# EAGLE board top_level (EAGLE 4.15), part 1 of 2
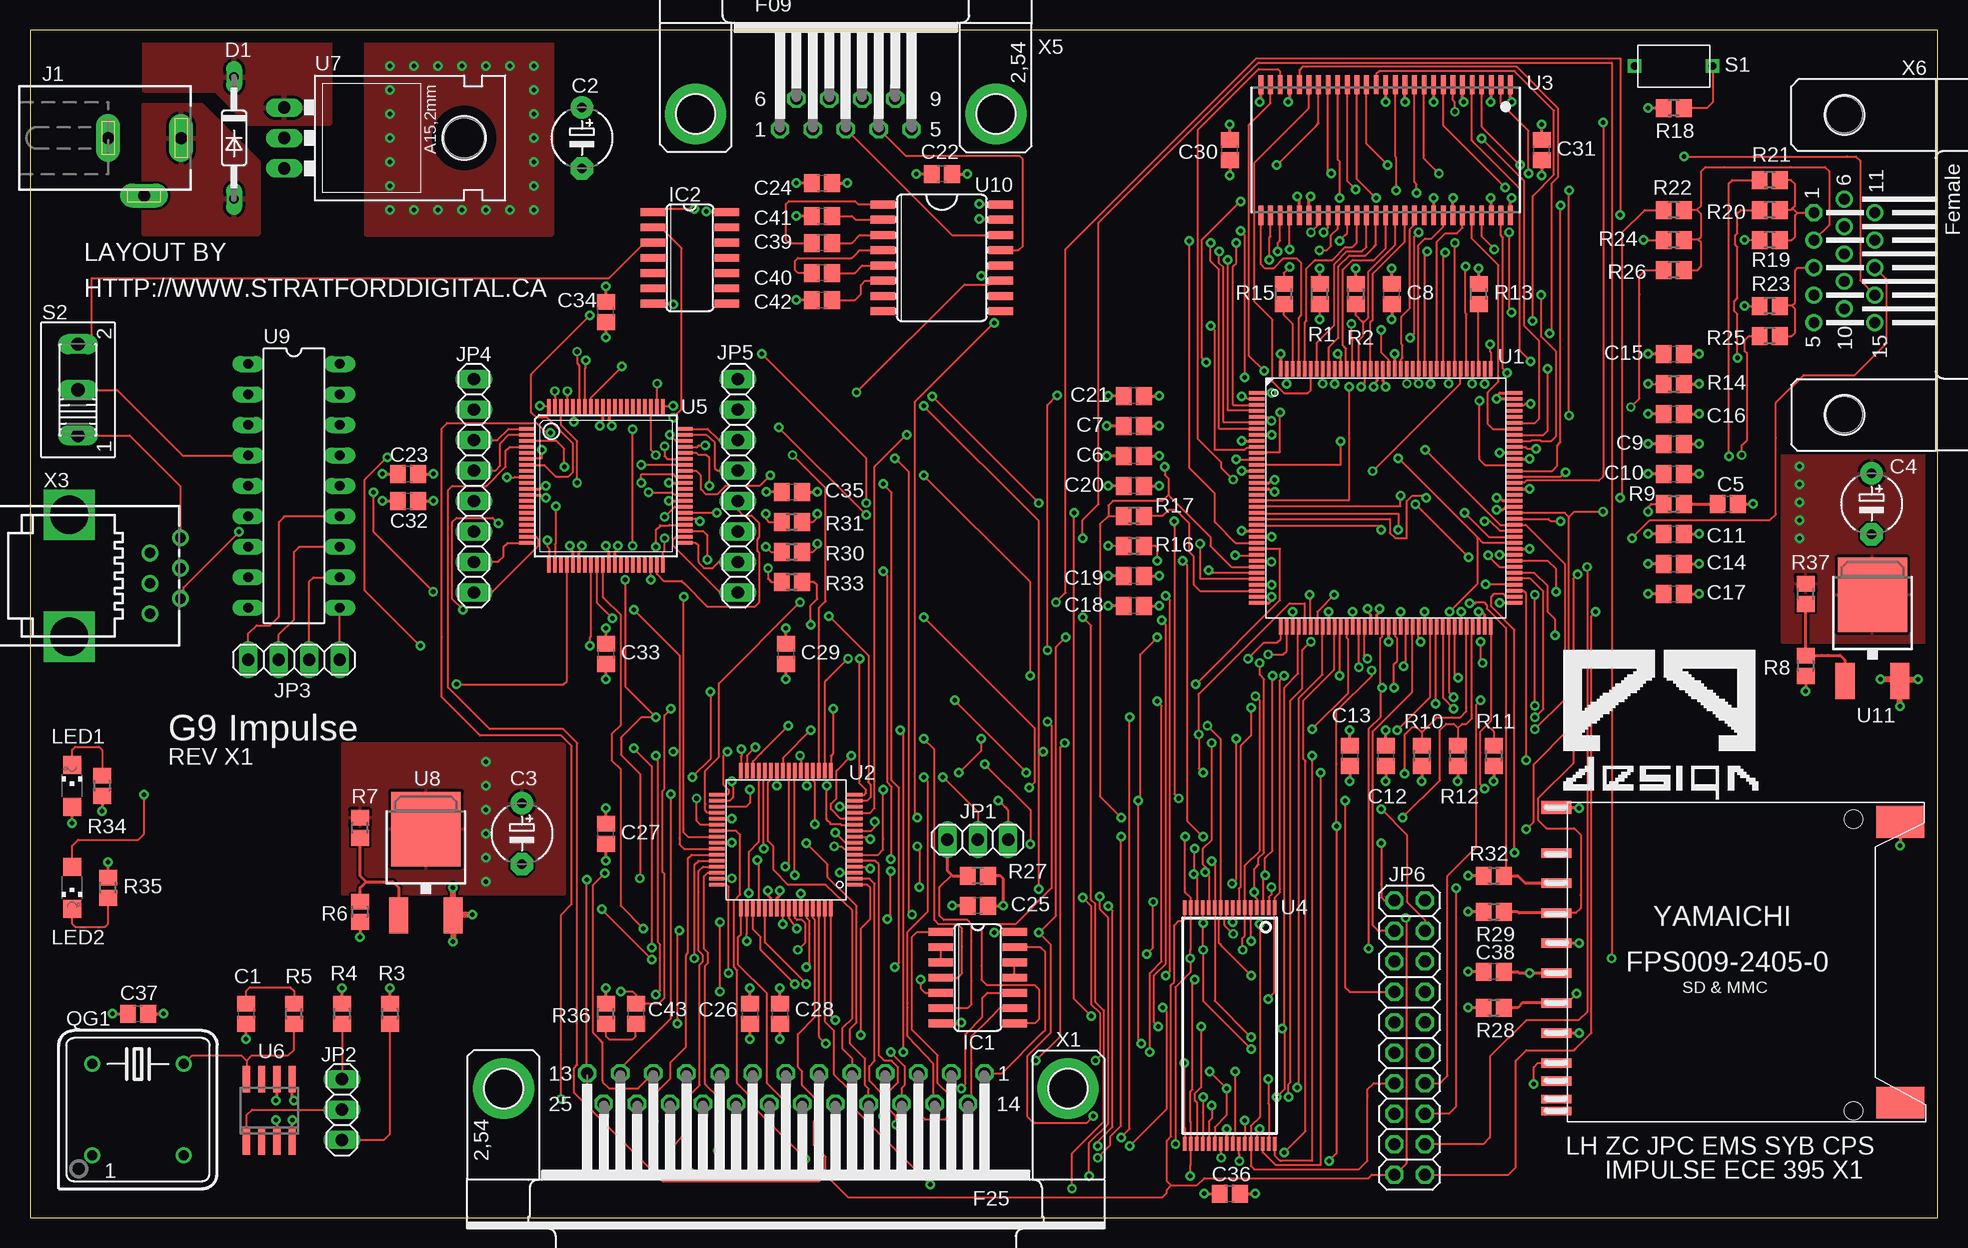
[diagram p1: board, top side]
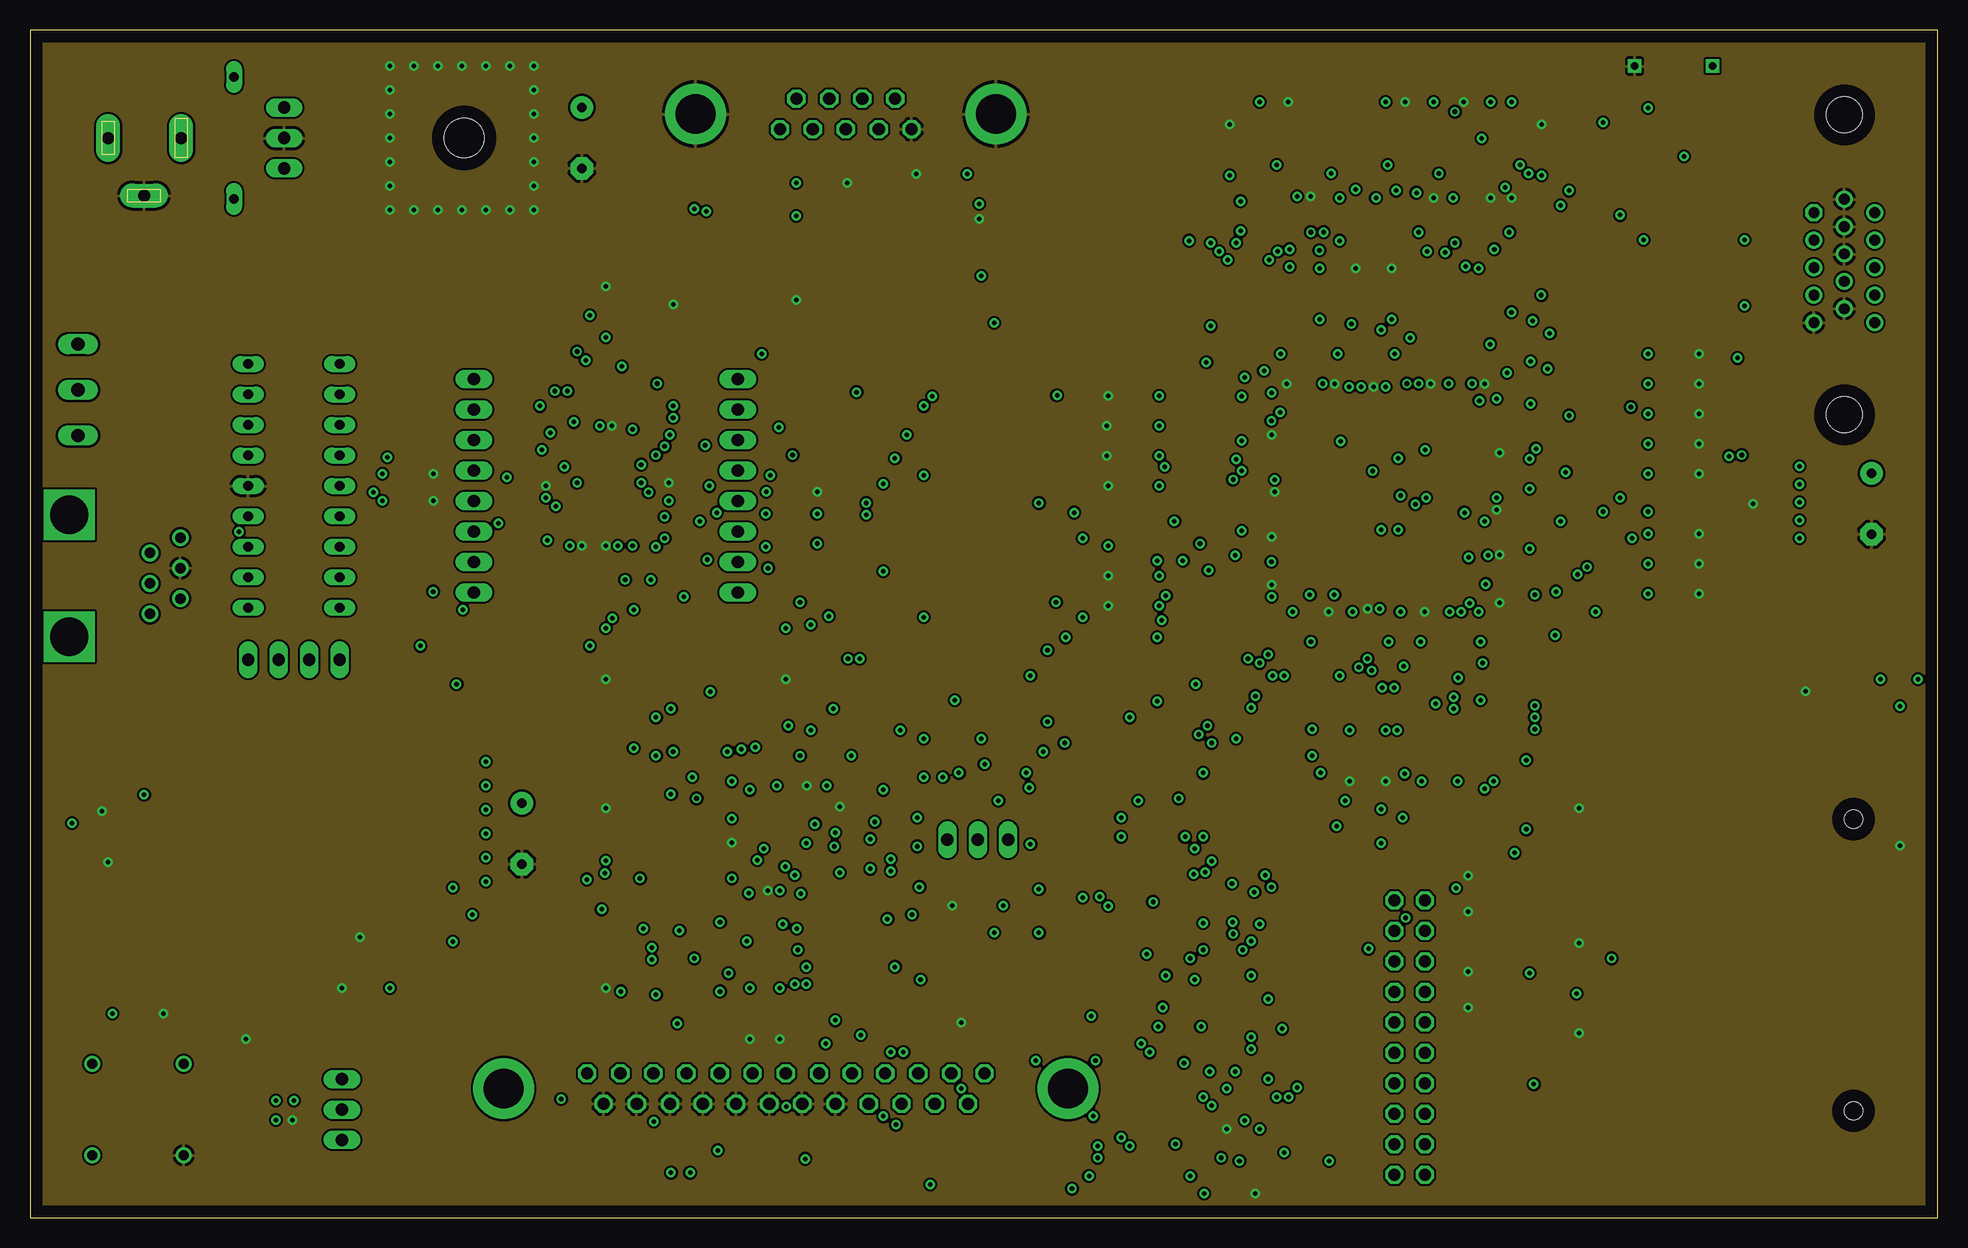
[diagram p2: board, inner layer GND]
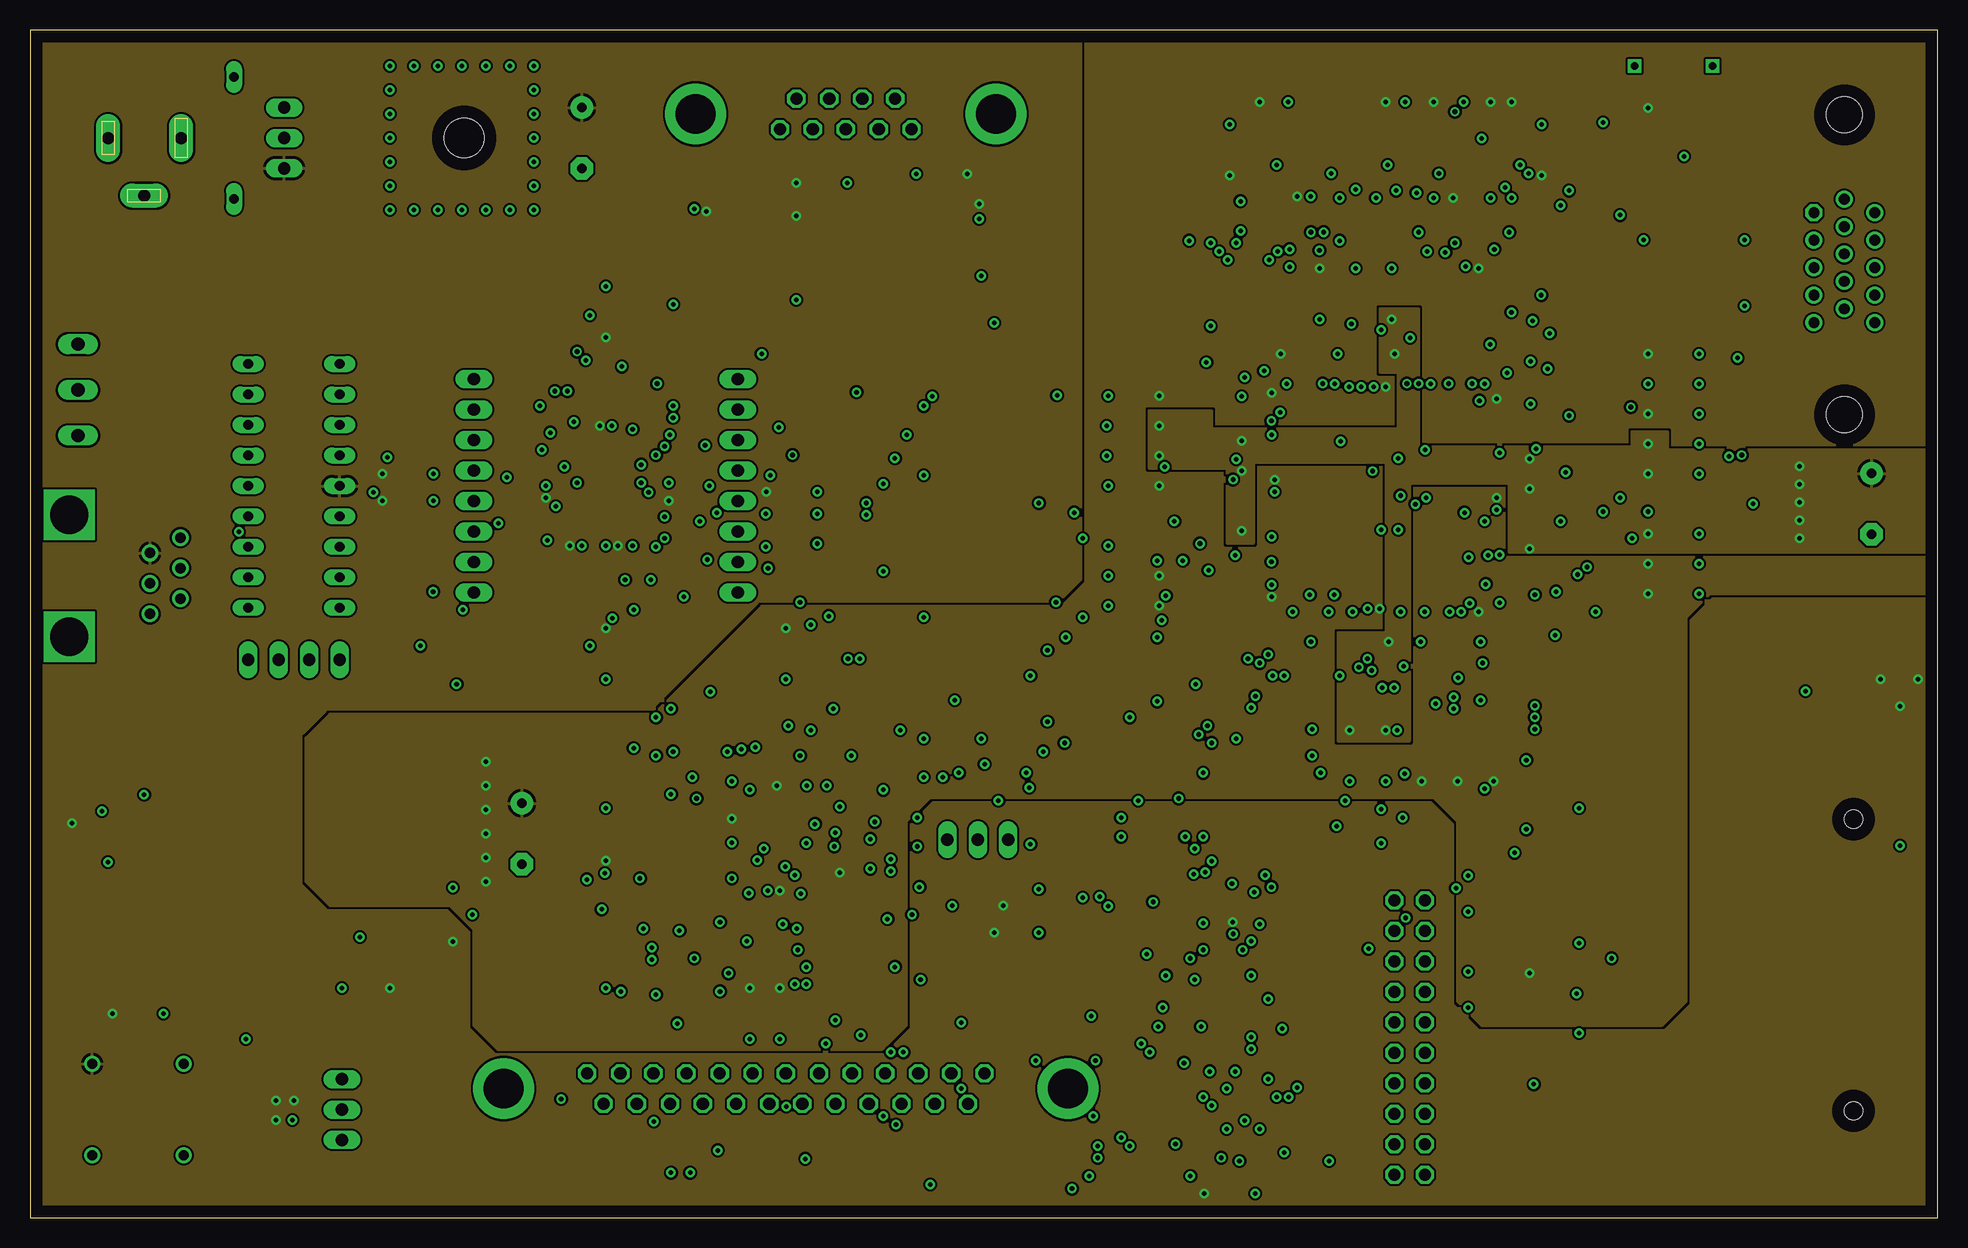
[diagram p3: board, inner layer POWER]
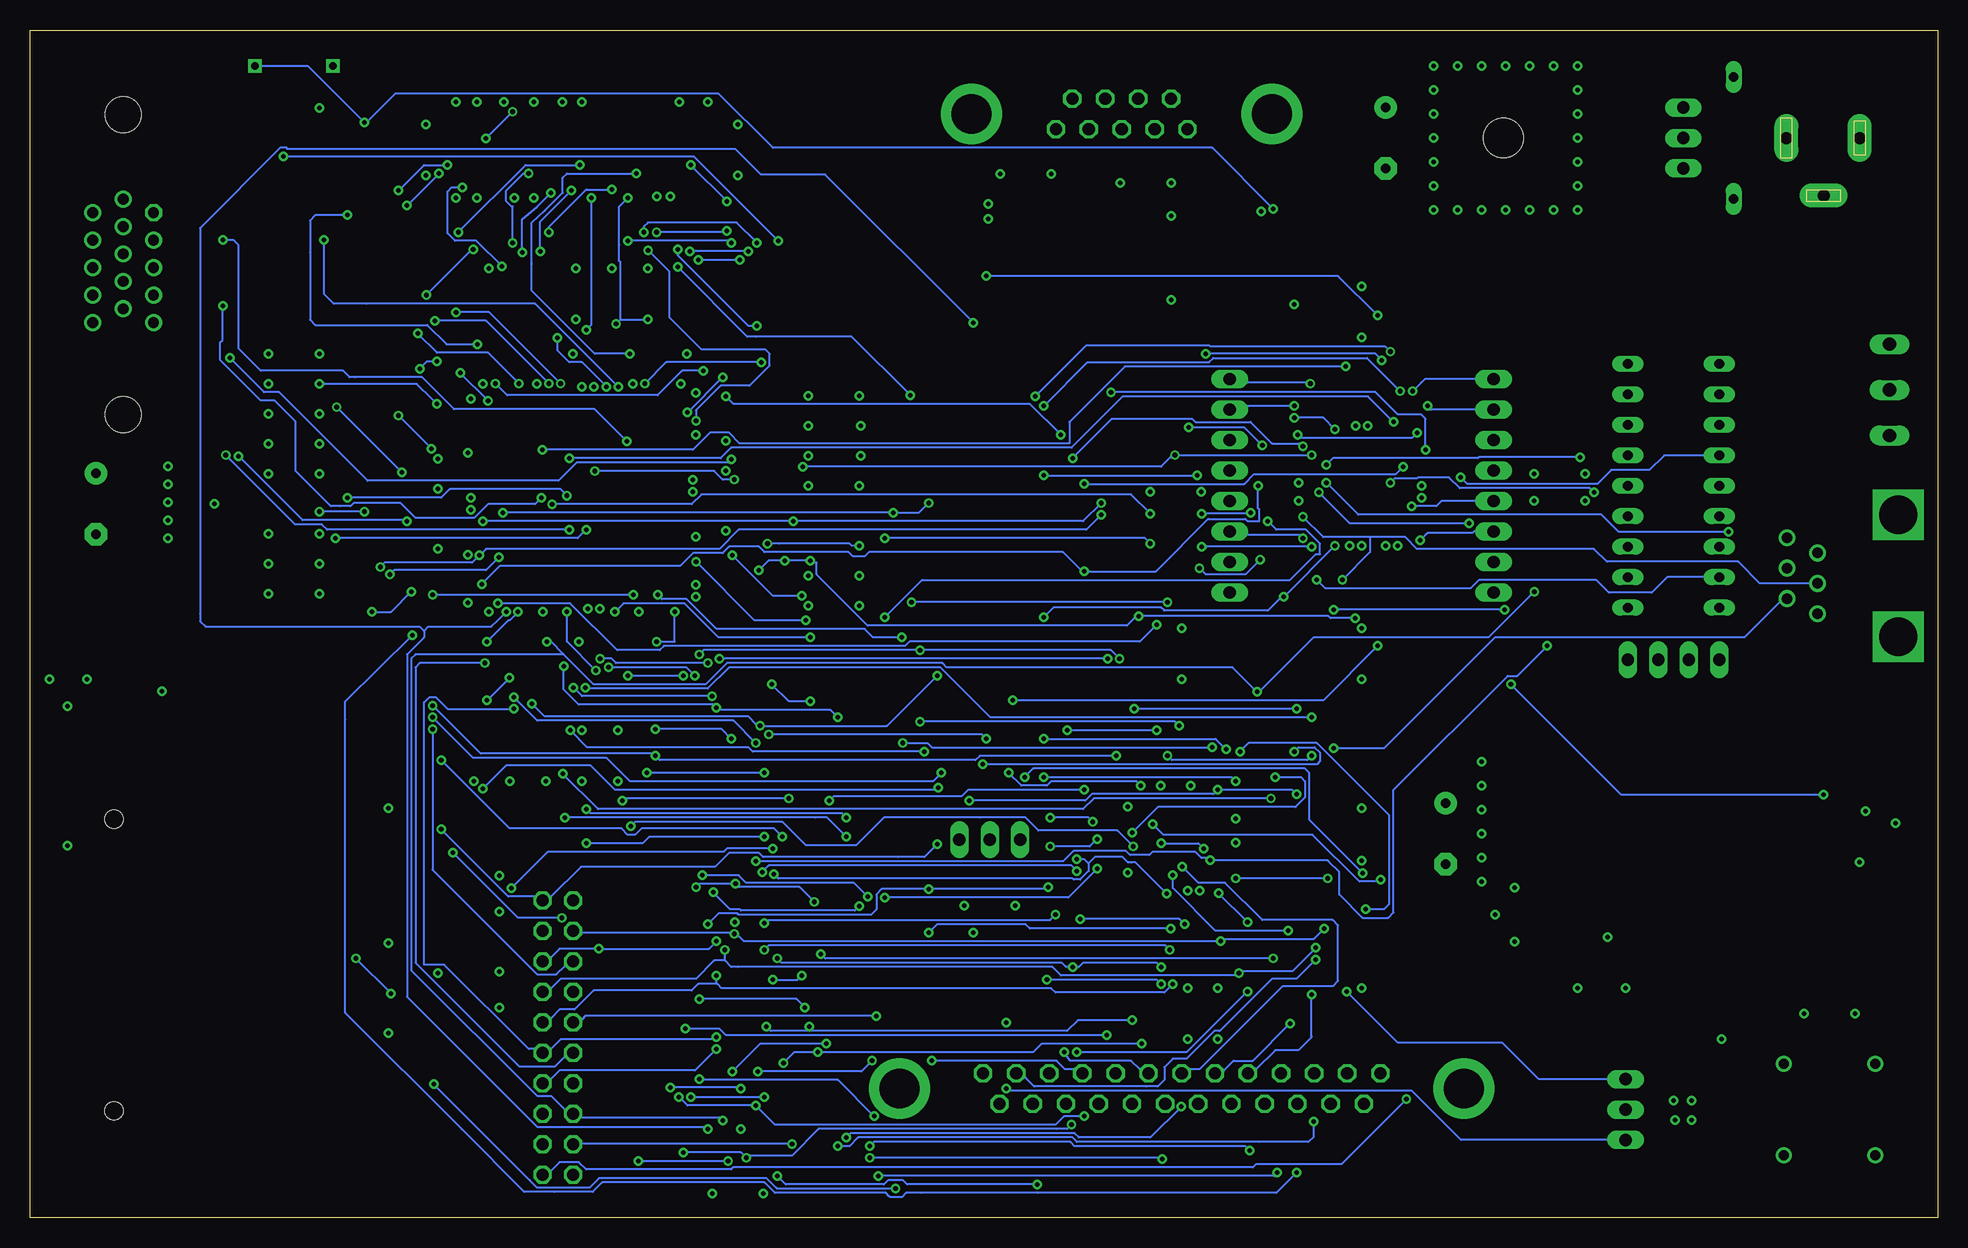
[diagram p4: board, bottom side, seen from below]

Size 159 x 99 mm. Coordinates in mm from the lower left corner, seen from the top.
Outline: 0,0 159,0 159,99 0,99 0,0
Copper layers (1*2+15*16): Top 0.035mm / dielectric 0.2mm / GND 0.035mm / dielectric 0.15mm / POWER 0.035mm / dielectric 0.2mm / Bottom 0.035mm
Design rules "default": minimum track width 7mil, minimum drill 15mil, track to track 7mil, track to pad 7mil, pad to pad 7mil, via to via 7mil, smd to smd 7mil, copper to edge 40mil, drill to drill 8mil, minimum pad ring 10mil, minimum via ring 8mil, stop-mask expansion 4mil, vias tented up to drill 0mil, thermal gap 10mil

## Footprints (pad centres in the part's own frame; a part is rotated, then mirrored left to right if it is on the bottom)
C0805 = smd 1.3 x 1.5: 1 -0.85,0; 2 0.85,0
E5-5 = drill 0.813 pad 1.905 round: + -2.54,0 | drill 0.813 pad 1.905 octagon: - 2.54,0
DO35-10 = drill 0.813 long: A 5.08,0; C -5.08,0
SO14 = smd 0.66 x 2.032: 1 -3.81,-3.073; 2 -2.54,-3.073; 3 -1.27,-3.073; 4 0,-3.073; 5 1.27,-3.073; 6 2.54,-3.073; 7 3.81,-3.073; 8 3.81,3.073; 9 2.54,3.073; 10 1.27,3.073; 11 0,3.073; 12 -1.27,3.073; 13 -2.54,3.073; 14 -3.81,3.073
DCJ0202 = drill 1 pad 2 long: 1 0,3.1; 2 4.8,0; 3 0,-3
1X03 = drill 1.016 long: 1 -2.54,0; 2 0,0; 3 2.54,0
1X04 = drill 1.016 long: 1 -3.81,0; 2 -1.27,0; 3 1.27,0; 4 3.81,0
1X08 = drill 1.016 long: 1 -8.89,0; 2 -6.35,0; 3 -3.81,0; 4 -1.27,0; 5 1.27,0; 6 3.81,0; 7 6.35,0; 8 8.89,0
2X10 = drill 1.016 octagon: 1 -11.43,-1.27; 2 -11.43,1.27; 3 -8.89,-1.27; 4 -8.89,1.27; 5 -6.35,-1.27; 6 -6.35,1.27; 7 -3.81,-1.27; 8 -3.81,1.27; 9 -1.27,-1.27; 10 -1.27,1.27; 11 1.27,-1.27; 12 1.27,1.27; 13 3.81,-1.27; 14 3.81,1.27; 15 6.35,-1.27; 16 6.35,1.27; 17 8.89,-1.27; 18 8.89,1.27; 19 11.43,-1.27; 20 11.43,1.27
CHIPLED_1206 = smd 1.5 x 1.5: A 0,-1.75; C 0,1.75
DIL08S = drill 0.813 round: 1 -3.81,-3.81; 4 3.81,-3.81; 5 3.81,3.81; 8 -3.81,3.81
R0805 = smd 1.3 x 1.5: 1 -0.85,0; 2 0.85,0
138-236 = drill 0.6 square: P$1 -3.25,0; P$2 3.25,0
255SB = drill 1.118 long: 1 -3.81,0; 2 0,0; 3 3.81,0
TQFP144 = smd 1.3 x 0.3: P$1 -10.75,8.75; P$2 -10.75,8.25; P$3 -10.75,7.75; P$4 -10.75,7.25; P$5 -10.75,6.75; P$6 -10.75,6.25; P$7 -10.75,5.75; P$8 -10.75,5.25; P$9 -10.75,4.75; P$10 -10.75,4.25; P$11 -10.75,3.75; P$12 -10.75,3.25; P$13 -10.75,2.75; P$14 -10.75,2.25; P$15 -10.75,1.75; P$16 -10.75,1.25; P$17 -10.75,0.75; P$18 -10.75,0.25; P$19 -10.75,-0.25; P$20 -10.75,-0.75; P$21 -10.75,-1.25; P$22 -10.75,-1.75; P$23 -10.75,-2.25; P$24 -10.75,-2.75; P$25 -10.75,-3.25; P$26 -10.75,-3.75; P$27 -10.75,-4.25; P$28 -10.75,-4.75; P$29 -10.75,-5.25; P$30 -10.75,-5.75; P$31 -10.75,-6.25; P$32 -10.75,-6.75; P$33 -10.75,-7.25; P$34 -10.75,-7.75; P$35 -10.75,-8.25; P$36 -10.75,-8.75; P$73 10.75,-8.75; P$74 10.75,-8.25; P$75 10.75,-7.75; P$76 10.75,-7.25; P$77 10.75,-6.75; P$78 10.75,-6.25; P$79 10.75,-5.75; P$80 10.75,-5.25; P$81 10.75,-4.75; P$82 10.75,-4.25; P$83 10.75,-3.75; P$84 10.75,-3.25; P$85 10.75,-2.75; P$86 10.75,-2.25; P$87 10.75,-1.75; P$88 10.75,-1.25; P$89 10.75,-0.75; P$90 10.75,-0.25; P$91 10.75,0.25; P$92 10.75,0.75; P$93 10.75,1.25; P$94 10.75,1.75; P$95 10.75,2.25; P$96 10.75,2.75; P$97 10.75,3.25; P$98 10.75,3.75; P$99 10.75,4.25; P$100 10.75,4.75; P$101 10.75,5.25; P$102 10.75,5.75; P$103 10.75,6.25; P$104 10.75,6.75; P$105 10.75,7.25; P$106 10.75,7.75; P$107 10.75,8.25; P$108 10.75,8.75 | smd 0.3 x 1.3: P$37 -8.75,-10.75; P$38 -8.25,-10.75; P$39 -7.75,-10.75; P$40 -7.25,-10.75; P$41 -6.75,-10.75; P$42 -6.25,-10.75; P$43 -5.75,-10.75; P$44 -5.25,-10.75; P$45 -4.75,-10.75; P$46 -4.25,-10.75; P$47 -3.75,-10.75; P$48 -3.25,-10.75; P$49 -2.75,-10.75; P$50 -2.25,-10.75; P$51 -1.75,-10.75; P$52 -1.25,-10.75; P$53 -0.75,-10.75; P$54 -0.25,-10.75; P$55 0.25,-10.75; P$56 0.75,-10.75; P$57 1.25,-10.75; P$58 1.75,-10.75; P$59 2.25,-10.75; P$60 2.75,-10.75; P$61 3.25,-10.75; P$62 3.75,-10.75; P$63 4.25,-10.75; P$64 4.75,-10.75; P$65 5.25,-10.75; P$66 5.75,-10.75; P$67 6.25,-10.75; P$68 6.75,-10.75; P$69 7.25,-10.75; P$70 7.75,-10.75; P$71 8.25,-10.75; P$72 8.75,-10.75; P$109 8.75,10.75; P$110 8.25,10.75; P$111 7.75,10.75; P$112 7.25,10.75; P$113 6.75,10.75; P$114 6.25,10.75; P$115 5.75,10.75; P$116 5.25,10.75; P$117 4.75,10.75; P$118 4.25,10.75; P$119 3.75,10.75; P$120 3.25,10.75; P$121 2.75,10.75; P$122 2.25,10.75; P$123 1.75,10.75; P$124 1.25,10.75; P$125 0.75,10.75; P$126 0.25,10.75; P$127 -0.25,10.75; P$128 -0.75,10.75; P$129 -1.25,10.75; P$130 -1.75,10.75; P$131 -2.25,10.75; P$132 -2.75,10.75; P$133 -3.25,10.75; P$134 -3.75,10.75; P$135 -4.25,10.75; P$136 -4.75,10.75; P$137 -5.25,10.75; P$138 -5.75,10.75; P$139 -6.25,10.75; P$140 -6.75,10.75; P$141 -7.25,10.75; P$142 -7.75,10.75; P$143 -8.25,10.75; P$144 -8.75,10.75
VQ64 = smd 1.3 x 0.3: P$1 -5.75,3.75; P$2 -5.75,3.25; P$3 -5.75,2.75; P$4 -5.75,2.25; P$5 -5.75,1.75; P$6 -5.75,1.25; P$7 -5.75,0.75; P$8 -5.75,0.25; P$9 -5.75,-0.25; P$10 -5.75,-0.75; P$11 -5.75,-1.25; P$12 -5.75,-1.75; P$13 -5.75,-2.25; P$14 -5.75,-2.75; P$15 -5.75,-3.25; P$16 -5.75,-3.75; P$33 5.75,-3.75; P$34 5.75,-3.25; P$35 5.75,-2.75; P$36 5.75,-2.25; P$37 5.75,-1.75; P$38 5.75,-1.25; P$39 5.75,-0.75; P$40 5.75,-0.25; P$41 5.75,0.25; P$42 5.75,0.75; P$43 5.75,1.25; P$44 5.75,1.75; P$45 5.75,2.25; P$46 5.75,2.75; P$47 5.75,3.25; P$48 5.75,3.75 | smd 0.3 x 1.3: P$17 -3.75,-5.75; P$18 -3.25,-5.75; P$19 -2.75,-5.75; P$20 -2.25,-5.75; P$21 -1.75,-5.75; P$22 -1.25,-5.75; P$23 -0.75,-5.75; P$24 -0.25,-5.75; P$25 0.25,-5.75; P$26 0.75,-5.75; P$27 1.25,-5.75; P$28 1.75,-5.75; P$29 2.25,-5.75; P$30 2.75,-5.75; P$31 3.25,-5.75; P$32 3.75,-5.75; P$49 3.75,5.75; P$50 3.25,5.75; P$51 2.75,5.75; P$52 2.25,5.75; P$53 1.75,5.75; P$54 1.25,5.75; P$55 0.75,5.75; P$56 0.25,5.75; P$57 -0.25,5.75; P$58 -0.75,5.75; P$59 -1.25,5.75; P$60 -1.75,5.75; P$61 -2.25,5.75; P$62 -2.75,5.75; P$63 -3.25,5.75; P$64 -3.75,5.75
TSOP54 = smd 0.4 x 1.6: 1 -10.4,-5.45; 2 -9.6,-5.45; 3 -8.8,-5.45; 4 -8,-5.45; 5 -7.2,-5.45; 6 -6.4,-5.45; 7 -5.6,-5.45; 8 -4.8,-5.45; 9 -4,-5.45; 10 -3.2,-5.45; 11 -2.4,-5.45; 12 -1.6,-5.45; 13 -0.8,-5.45; 14 0,-5.45; 15 0.8,-5.45; 16 1.6,-5.45; 17 2.4,-5.45; 18 3.2,-5.45; 19 4,-5.45; 20 4.8,-5.45; 21 5.6,-5.45; 22 6.4,-5.45; 23 10.4,5.45; 24 9.6,5.45; 25 8.8,5.45; 26 8,5.45; 27 7.2,5.45; 28 6.4,5.45; 29 5.6,5.45; 30 4.8,5.45; 31 4,5.45; 32 3.2,5.45; 33 2.4,5.45; 34 1.6,5.45; 35 0.8,5.45; 36 0,5.45; 37 -0.8,5.45; 38 -1.6,5.45; 39 -2.4,5.45; 40 -3.2,5.45; 41 -4,5.45; 42 -4.8,5.45; 43 -5.6,5.45; 44 -6.4,5.45; 45 7.2,-5.45; 46 8,-5.45; 47 8.8,-5.45; 48 9.6,-5.45; 49 10.4,-5.45; 50 -7.2,5.45; 51 -8,5.45; 52 -8.8,5.45; 53 -9.6,5.45; 54 -10.4,5.45
TSOP32 = smd 1.2 x 0.3: 1 -9.85,3.75; 2 -9.85,3.25; 3 -9.85,2.75; 4 -9.85,2.25; 5 -9.85,1.75; 6 -9.85,1.25; 7 -9.85,0.75; 8 -9.85,0.25; 9 -9.85,-0.25; 10 -9.85,-0.75; 11 -9.85,-1.25; 12 -9.85,-1.75; 13 -9.85,-2.25; 14 -9.85,-2.75; 15 -9.85,-3.25; 16 -9.85,-3.75; 17 9.85,-3.75; 18 9.85,-3.25; 19 9.85,-2.75; 20 9.85,-2.25; 21 9.85,-1.75; 22 9.85,-1.25; 23 9.85,-0.75; 24 9.85,-0.25; 25 9.85,0.25; 26 9.85,0.75; 27 9.85,1.25; 28 9.85,1.75; 29 9.85,2.25; 30 9.85,2.75; 31 9.85,3.25; 32 9.85,3.75
TQFP80 = smd 1.3 x 0.27: 1 -6.595,4.75; 2 -6.595,4.25; 3 -6.595,3.75; 4 -6.595,3.25; 5 -6.595,2.75; 6 -6.595,2.25; 7 -6.595,1.75; 8 -6.595,1.25; 9 -6.595,0.75; 10 -6.595,0.25; 11 -6.595,-0.25; 12 -6.595,-0.75; 13 -6.595,-1.25; 14 -6.595,-1.75; 15 -6.595,-2.25; 16 -6.595,-2.75; 17 -6.595,-3.25; 18 -6.595,-3.75; 19 -6.595,-4.25; 20 -6.595,-4.75; 41 6.595,-4.75; 42 6.595,-4.25; 43 6.595,-3.75; 44 6.595,-3.25; 45 6.595,-2.75; 46 6.595,-2.25; 47 6.595,-1.75; 48 6.595,-1.25; 49 6.595,-0.75; 50 6.595,-0.25; 51 6.595,0.25; 52 6.595,0.75; 53 6.595,1.25; 54 6.595,1.75; 55 6.595,2.25; 56 6.595,2.75; 57 6.595,3.25; 58 6.595,3.75; 59 6.595,4.25; 60 6.595,4.75 | smd 0.27 x 1.3: 21 -4.75,-6.595; 22 -4.25,-6.595; 23 -3.75,-6.595; 24 -3.25,-6.595; 25 -2.75,-6.595; 26 -2.25,-6.595; 27 -1.75,-6.595; 28 -1.25,-6.595; 29 -0.75,-6.595; 30 -0.25,-6.595; 31 0.25,-6.595; 32 0.75,-6.595; 33 1.25,-6.595; 34 1.75,-6.595; 35 2.25,-6.595; 36 2.75,-6.595; 37 3.25,-6.595; 38 3.75,-6.595; 39 4.25,-6.595; 40 4.75,-6.595; 61 4.75,6.595; 62 4.25,6.595; 63 3.75,6.595; 64 3.25,6.595; 65 2.75,6.595; 66 2.25,6.595; 67 1.75,6.595; 68 1.25,6.595; 69 0.75,6.595; 70 0.25,6.595; 71 -0.25,6.595; 72 -0.75,6.595; 73 -1.25,6.595; 74 -1.75,6.595; 75 -2.25,6.595; 76 -2.75,6.595; 77 -3.25,6.595; 78 -3.75,6.595; 79 -4.25,6.595; 80 -4.75,6.595
SOIC8_150MIL = smd 0.6 x 2.2: 1 -1.956,-2.667; 2 -0.686,-2.667; 3 0.584,-2.667; 4 1.854,-2.667; 5 1.854,2.533; 6 0.584,2.533; 7 -0.686,2.533; 8 -1.956,2.533
78XXL = drill 1.016 long: GND 0,-3.81; IN -2.54,-3.81; OUT 2.54,-3.81 | hole 3.302: 0,11.176
DPACK = smd 1.6 x 3: 1 -2.28,-4.8; 3 2.28,-4.8 | smd 5.8 x 6.2: 4 0,2.38
DIL18 = drill 0.813 long: 1 -10.16,-3.81; 2 -7.62,-3.81; 3 -5.08,-3.81; 4 -2.54,-3.81; 5 0,-3.81; 6 2.54,-3.81; 7 5.08,-3.81; 8 7.62,-3.81; 9 10.16,-3.81; 10 10.16,3.81; 11 7.62,3.81; 12 5.08,3.81; 13 2.54,3.81; 14 0,3.81; 15 -2.54,3.81; 16 -5.08,3.81; 17 -7.62,3.81; 18 -10.16,3.81
SO16L = smd 0.66 x 2.032: 1 -4.445,-4.902; 2 -3.175,-4.902; 3 -1.905,-4.902; 4 -0.635,-4.902; 5 0.635,-4.902; 6 1.905,-4.902; 7 3.175,-4.902; 8 4.445,-4.902; 9 4.445,4.902; 10 3.175,4.902; 11 1.905,4.902; 12 0.635,4.902; 13 -0.635,4.902; 14 -1.905,4.902; 15 -3.175,4.902; 16 -4.445,4.902
F25HP = drill 1.016 octagon: 1 -16.561,-1.27; 2 -13.792,-1.27; 3 -11.049,-1.27; 4 -8.28,-1.27; 5 -5.512,-1.27; 6 -2.769,-1.27; 7 0,-1.27; 8 2.769,-1.27; 9 5.512,-1.27; 10 8.28,-1.27; 11 11.049,-1.27; 12 13.792,-1.27; 13 16.561,-1.27; 14 -15.189,1.27; 15 -12.421,1.27; 16 -9.652,1.27; 17 -6.909,1.27; 18 -4.14,1.27; 19 -1.372,1.27; 20 1.372,1.27; 21 4.14,1.27; 22 6.909,1.27; 23 9.652,1.27; 24 12.421,1.27; 25 15.189,1.27 | drill 3.302 pad 5.08 round: G1 -23.52,0; G2 23.52,0
RJ45_6PIN = drill 0.889 round: 1 -3.175,10.541; 2 -1.905,8.001; 3 -0.635,10.541; 4 0.635,8.001; 5 1.905,10.541; 6 3.175,8.001 | drill 3.2 square: P$1 -5.08,1.27; P$2 5.08,1.27
FPS009-2405 = smd 2.5 x 0.8: P$1 -14.27,6.88; P$2 -14.27,4.38; P$3 -14.27,1.88; P$4 -14.27,-0.62; P$5 -14.27,-3.12; P$6 -14.27,-5.62; P$7 -14.27,-8.12; P$8 -14.27,-9.62; P$9 -14.27,9.38 | smd 4 x 2.65: P$10 14.4,-11.42; P$14 14.4,11.98 | smd 2.5 x 0.7: P$11 -14.27,-11.12; P$12 -14.27,-12.12 | smd 2.5 x 1.1: P$13 -14.27,13.18 | hole 1.5: 10.5,12.2; 10.5,-12.1
F09HP = drill 1.016 octagon: 1 -5.486,-1.27; 2 -2.743,-1.27; 3 0,-1.27; 4 2.743,-1.27; 5 5.486,-1.27; 6 -4.115,1.27; 7 -1.372,1.27; 8 1.372,1.27; 9 4.115,1.27 | drill 3.302 pad 5.08 round: G1 -12.522,0; G2 12.522,0
HDF15H = drill 0.9 octagon: 1 4.329,2.54 | drill 0.9 round: 2 2.043,2.54; 3 -0.243,2.54; 4 -2.529,2.54; 5 -4.815,2.54; 6 5.472,0; 7 3.186,0; 8 0.9,0; 9 -1.386,0; 10 -3.672,0; 11 4.329,-2.54; 12 2.043,-2.54; 13 -0.243,-2.54; 14 -2.529,-2.54; 15 -4.815,-2.54 | hole 3: -12.5,0; 12.5,0

## Placement (x,y rotation side)
C1  .01uF  [C0805]  18,17 270 top
C2  10uF  [E5-5]  46,90 270 top
C3  10uF  [E5-5]  41,32 270 top
C4  10uF  [E5-5]  153.5,59.5 270 top
C5  .01uF  [C0805]  141.5,59.5 0 top
C6  .01uF  [C0805]  92,63.5 180 top
C7  .01uF  [C0805]  92,66 180 top
C8  .01uF  [C0805]  113.5,77 90 top
C9  .01uF  [C0805]  137,64.5 0 top
C10  .01uF  [C0805]  137,62 0 top
C11  .01uF  [C0805]  137,57 0 top
C12  .01uF  [C0805]  113,38.5 270 top
C13  .01uF  [C0805]  110,38.5 270 top
C14  .01uF  [C0805]  137,54.5 0 top
C15  .01uF  [C0805]  137,72 0 top
C16  .01uF  [C0805]  137,67 0 top
C17  .01uF  [C0805]  137,52 0 top
C18  .01uF  [C0805]  92,51 180 top
C19  .01uF  [C0805]  92,53.5 180 top
C20  .01uF  [C0805]  92,61 180 top
C21  .01uF  [C0805]  92,68.5 180 top
C22  .01uF  [C0805]  76,87 180 top
C23  .01uF  [C0805]  31.5,62 0 top
C24  .01uF  [C0805]  66,86.25 0 top
C25  .01uF  [C0805]  79,26 180 top
C26  .01uF  [C0805]  60,17 270 top
C27  .01uF  [C0805]  48,32 90 top
C28  .01uF  [C0805]  62.5,17 270 top
C29  .01uF  [C0805]  63,47 270 top
C30  .01uF  [C0805]  100,89 90 top
C31  .01uF  [C0805]  126,89 90 top
C32  .01uF  [C0805]  31.5,59.75 0 top
C33  .01uF  [C0805]  48,47 270 top
C34  .01uF  [C0805]  48,75.5 90 top
C35  .01uF  [C0805]  63.5,60.5 0 top
C36  .01uF  [C0805]  100,2 0 top
C37  .01uF  [C0805]  9,17 0 top
C38  .01uF  [C0805]  122,20.5 180 top
C39  .01uF  [C0805]  66,81.25 180 top
C40  .01uF  [C0805]  66,78.75 180 top
C41  .01uF  [C0805]  66,83.5 0 top
C42  .01uF  [C0805]  66,76.5 0 top
C43  .01uF  [C0805]  50.5,17 270 top
D1  1N4148  [DO35-10]  17,90 270 top
IC1  74LS14D  [SO14]  79,20 270 top
IC2  74ALS08D  [SO14]  55,80 270 top
J1  DCJ0202  [DCJ0202]  9.5,90 270 top
JP1  [1X03]  79,31.5 180 top
JP2  [1X03]  26,9 90 top
JP3  [1X04]  22,46.5 0 top
JP4  [1X08]  37,61 270 top
JP5  [1X08]  59,61 270 top
JP6  [2X10]  115,15 90 top
LED1  [CHIPLED_1206]  3.5,36 0 top
LED2  [CHIPLED_1206]  3.5,27.5 180 top
QG1  50.000Mhz  [DIL08S]  9,9 0 top
R1  4.7K  [R0805]  107.5,77 90 top
R2  4.7K  [R0805]  110.5,77 270 top
R3  4.7K  [R0805]  30,17 270 top
R4  4.7K  [R0805]  26,17 270 top
R5  50  [R0805]  22,17 90 top
R6  765  [R0805]  27.5,25.5 270 top
R7  464  [R0805]  27.5,32.5 90 top
R8  240  [R0805]  148,46 270 top
R9  50  [R0805]  137,59.5 0 top
R10  4.7K  [R0805]  116,38.5 270 top
R11  4.7K  [R0805]  122,38.5 270 top
R12  4.7K  [R0805]  119,38.5 270 top
R13  4.7K  [R0805]  120.75,77 90 top
R14  [R0805]  137,69.5 0 top
R15  330  [R0805]  104.5,77 90 top
R16  330  [R0805]  92,56 0 top
R17  330  [R0805]  92,58.5 180 top
R18  4.7K  [R0805]  137,92.5 180 top
R19  470  [R0805]  145,81.5 180 top
R20  1.0K  [R0805]  145,84 180 top
R21  1.8K  [R0805]  145,86.5 180 top
R22  470  [R0805]  137,84 180 top
R23  330  [R0805]  145,76 180 top
R24  1.0K  [R0805]  137,81.5 180 top
R25  680  [R0805]  145,73.5 180 top
R26  1.8K  [R0805]  137,79 180 top
R27  2.2K  [R0805]  79,28.5 180 top
R28  33K  [R0805]  122,17.5 0 top
R29  33K  [R0805]  122,25.5 0 top
R30  22K  [R0805]  63.5,55.5 0 top
R31  22K  [R0805]  63.5,58 0 top
R32  33K  [R0805]  122,28.5 0 top
R33  22K  [R0805]  63.5,53 0 top
R34  1K  [R0805]  6,36 270 top
R35  220  [R0805]  6.5,27.5 90 top
R36  50  [R0805]  48,17 90 top
R37  240  [R0805]  148,52 90 top
S1  ALCOSWITCH_FSM  [138-236]  137,96 180 top
S2  [255SB]  4,69 90 top
U1  XC2S50/100-TQFP144  [TQFP144]  113,60 0 top
U2  XC9572XL-VQ64  [VQ64]  63,31.5 180 top
U3  K4S561632E-TC60/75  [TSOP54]  113,89 180 top
U4  AT74F002-TSOP32  [TSOP32]  100,16 270 top
U5  PIC18F8722  [TQFP80]  48,61 0 top
U6  DS1075_SOIC8  [SOIC8_150MIL]  20,9 0 top
U7  [78XXL]  25,90 270 top
U8  LM317MABDT  [DPACK]  33,30 0 top
U9  PIC16F84AP  [DIL18]  22,61 270 top
U10  MAX232ECWE  [SO16L]  76,80 270 top
U11  LM317MABDT  [DPACK]  153.57,49.54 0 top
X1  [F25HP]  63,10.75 180 top
X3  RJ45-6PIN  [RJ45_6PIN]  2,53.5 270 top
X4  FPS009-2405-0  [FPS009-2405]  141.5,21 0 top
X5  [F09HP]  68,92 0 top
X6  [HDF15H]  151.24,79.43 90 top

## Tracks (layer width: path | path; a pad name or v marks a point on that pad's centre or on a via)
+2V5  (via drill 0.38)
  Top 0.254: C7.1 v94.12,66 | C6.1 v94.12,63.5 | v101,64.75 U1.P$9 | v101,62.25 U1.P$14 | C8.1 v113.5,74.88 | C9.1 v134.88,64.5 | U1.P$125 v113.75,72 | C11.1 v134.88,57 | U1.P$82 v125,55.75 | U1.P$92 v125,60.75 | U1.P$97 v125,63.25 | C10.1 v134.88,62 | C12.1 v113,40.62 | C13.1 v110,40.62 | v113.25,48 U1.P$55 | v101,57.25 U1.P$24
  other vias: 147.5,62.62 147.5,61.12 147.5,59.62 147.5,58.12 147.5,56.62
  pour Top: 146,63.5 146,48 161,48 161,63.5
  pour POWER: 112.5,75.75 112.5,70.5 114,70.5 114,65.75 98.5,65.75 98.5,67.25 93.25,67.25 93.25,62.5 99.75,62.5 99.75,56.25 102,56.25 102,63 113,63 113,48.75 109,48.75 109,39.75 115,39.75 115,61.25 123.25,61.25 123.25,55.5 162,55.5 162,64 136.5,64 136.5,65.5 133.5,65.5 133.5,64.25 115.75,64.25 115.75,75.75
+3V3  (via drill 0.38)
  Top 0.178: 125.35,20.38 125.35,20.45 v125,20.38
  Top 0.254: U3.49 102.6,93.1 v102.5,93 | v113,93 U3.14 | v117,93 U3.9 | U3.3 121.8,93.05 v121.75,93 | U3.1 123.4,93.1 v123.5,93 | U3.43 118.6,84.97 v118.62,85 | U3.27 105.8,84.95 v105.62,85.12 | C30.1 v100,86.88 | C31.1 v126,86.88 | U2.P$55 62.25,26.62 62.38,26.75 62.5,26.88 v62.5,27.25 | v67.5,28.75 U2.P$3 | U2.P$26 v62.25,36 | U2.P$37 v58.5,33.25 | U1.P$16 103.25,61.25 103.5,61.5 v103.75,61.5 | U1.P$1 v103.5,68.75 | U1.P$144 v104.25,72 | U1.P$127 112.75,69.75 113,69.5 v113,69.25 | U1.P$107 v122.25,68.25 122.25,68.5 122.5,68.75 U1.P$108 | U1.P$90 122.75,59.75 122.5,60 v122.25,60 | U1.P$70 v120.75,50.5 121,50.5 121.25,50.25 U1.P$71 | U1.P$53 112.25,50.25 112.5,50.5 v112.5,50.75 | U1.P$35 v103.5,51.75 103.5,51.5 103.25,51.25 U1.P$36 | C20.1 v94.12,61 | C19.1 v94.12,53.5 | C18.1 v94.12,51 | R10.2 v116,36.38 | R12.2 v119,36.38 | R11.2 v122,36.38 | C17.1 v134.88,52 | C14.1 v134.88,54.5 | C15.1 v134.88,72 | C16.1 v134.88,67 | R13.2 v120.75,79.12 | R1.2 v107.5,79.12 | C21.1 v94.12,68.5 | R18.2 v134.88,92.5 | C29.1 v63,49.12 | C26.1 v60,19.12 | C28.1 v62.5,19.12 | v48,29.75 C27.1 | X4.P$4 125.35,20.38 124.12,20.38 124,20.5 123,20.5 C38.1
  other vias: 38,38 38,36 38,34 38,30 38,32 38,28
  pour POWER (rank 2): 23,40 25,42 52,42 61,51 86,51 88,53 88,104 165,104 165,52 140,52 138,50 138,18 136,16 121,16 119,18 119,33 117,35 75,35 73,33 73,16 71,14 39,14 37,16 37,24 35,26 25,26 23,28
  pour Top (rank 2): 26,39.5 26,27 44.58,27 44.58,39.5
+5V  (via drill 0.38)
  Top 0.178: 35.84,25.28 35.84,25.31 U8.3 35.22,26.56 35.28,26.56 | U11.3 155.93,44.72 155.93,44.85 | 35.28,27.57 35.29,27.56 35.29,27.54 v35.25,27.5 | 36.97,25.28 36.97,25.25 36.98,25.25 v36.88,25.25
  Top 0.254: U5.12 42.5,60.25 42.75,60 v43,60 | v47.5,66 47.5,66.25 47.75,66.5 U5.71 | v53.25,59.75 U5.48 | U5.32 48.75,55.5 49,55.75 v49,56 | U5.25 45.25,55.5 45,55.75 v45,56 | U10.16 79.18,84.44 v79.12,84.5 | IC2.14 56.44,83.81 v56.38,83.88 | C41.1 v63.88,83.5 | C24.1 v63.88,86.25 | C22.1 v78.12,87 | v6.88,17 C37.1 | v100.25,24.62 U4.8 | IC1.14 80.56,23.81 v80.38,23.75 | C25.1 v81.12,26 81.12,28.25 80.88,28.5 R27.1 | v97.88,2 C36.1 | C35.1 v61.38,60.5 | v29.38,62 C23.1 | v29.38,59.75 C32.1 | v48,73.38 C34.1 | v3.5,32.88 LED1.A | U6.3 20.58,8.04 v20.5,8.12 | U6.6 20.58,9.83 v20.5,9.75 | U6.5 21.85,9.9 v22,9.75 | R3.1 v30,19.12 | C33.1 v48,49.12
  Top 0.508: U8.3 35.28,23.03 v35.25,23 | 35.28,25.41 35.28,26.56 35.28,27.57 | 34.8,25.28 35.84,25.28 36.97,25.28 | U11.3 155.85,42.65 v155.88,42.62 | 154.26,44.85 155.93,44.85 157.35,44.85
  other vias: 157.38,44.88 154.25,44.88
  pour POWER (rank 6): -1,-1 160,-1 160,100 -1,100
GND  (via drill 0.38)
  Top 0.254: v53.25,61.25 U5.51 | U5.26 45.75,55.25 45.75,55.5 46,55.75 v46,56 | U5.31 48.25,55.5 48,55.75 v48,56 | U5.70 48.25,66.5 48.5,66.25 v48.5,66 | U5.11 42.5,60.75 42.75,61 v43,61 | C30.2 v100,91.12 | C31.2 v126,91.12 | IC2.7 53.69,76.19 v53.62,76.12 | U10.15 79.2,83.17 v79.12,83.25 | C42.1 v63.88,76.5 | C24.2 v68.12,86.25 | C22.2 v73.88,87 | X4.P$14 155.9,31.15 v155.88,31 | X4.P$13 129.07,34.18 v129.12,34.12 | X4.P$3 129,22.88 v129.12,22.88 | X4.P$6 129.25,15.38 v129.12,15.38 | C37.2 v11.12,17 | U6.4 21.85,7.98 v21.88,8.12 | v67.5,34.25 U2.P$14 | U2.P$21 v64.75,36 | U2.P$41 v58.5,31.25 | U2.P$54 61.75,26.62 61.5,26.88 v61.5,27.25 | U4.24 v99.75,7.38 | C25.2 v76.88,26 | IC1.7 77.56,16.19 v77.62,16.25 | C36.2 v102.12,2 | U1.P$17 103.25,60.75 103.5,60.5 v103.75,60.5 | U1.P$25 v103.5,56.75 | U1.P$8 v103.5,65.25 | U1.P$143 v104.75,69.5 | U1.P$135 v108.75,69.5 | U1.P$128 112.25,69.75 112,69.5 v112,69.25 | U1.P$119 v116.75,69.5 | U1.P$110 v121.25,69.5 | U1.P$98 v122.5,63.75 | v122.25,59 122.75,59 123,59.25 U1.P$89 | U1.P$81 v122.5,55.25 | U1.P$73 v122.5,51.25 | U1.P$61 v116.25,50.5 | U1.P$52 111.75,50.25 111.5,50.5 v111.5,50.75 | U1.P$45 v108.25,50.5 | U1.P$33 v103.5,52.75 | C19.2 v89.88,53.5 | C20.2 v89.88,61 | C6.2 v89.75,63.5 | C7.2 v89.75,66 | C8.2 v113.5,79.12 | C9.2 v139.12,64.5 | C21.2 v89.88,68.5 | R2.1 v110.5,79.12 | U3.28 106.6,84.97 v106.75,85.12 | U3.41 v117,85 | U3.52 121.8,84.95 v121.75,85 | U3.54 123.4,84.9 v123.5,85 | U3.6 119.4,93.1 v119.5,93 | U3.12 114.6,93.15 v114.62,93 | U3.46 105,93.12 v104.88,93 | C11.2 v139.12,57 | C5.2 v143.62,59.5 | C14.2 v139.12,54.5 | C10.2 v139.12,62 | C16.2 v139.12,67 | R14.2 v139.12,69.5 | C15.2 v139.12,72 | C13.2 v110,36.38 | C12.2 v113,36.38
  Top 0.254: C18.2 v89.88,51 | C17.2 v139.12,52 | R8.2 v148,43.88 | v63,44.88 C29.2 | C35.2 v65.62,60.5 | R36.2 v48,19.12 | v60,14.88 C26.2 | v62.5,14.88 C28.2 | v18,14.88 C1.2 | C27.2 v48,34.12 | v48,44.88 C33.2 | R4.1 v26,19.12 | R32.1 v119.88,28.5 | R29.1 v119.88,25.5 | C38.2 v119.88,20.5 | R28.1 v119.88,17.5 | R35.2 v6.5,29.62 | C23.2 v33.62,62 | C32.2 v33.62,59.75 | C34.2 v48,77.62 | R34.2 v6,33.88 | R6.2 v27.5,23.38
  other vias: 30,96 30,94 30,92 30,90 30,88 30,86 30,84 32,84 34,84 36,84 38,84 42,84 42,86 42,88 42,90 42,92 42,94 42,96 38,96 36,96 34,96 32,96 40,84 40,96
  pour GND (rank 6): -1,-1 160,-1 160,100 -1,100
  pour Top (rank 2): 28,100 28,82 43.5,82 43.5,100
N$1
  Top 0.178: IC1.11 82.06,20.27 82.06,20.98 IC1.12
N$2
  Top 0.178: IC1.3 75.92,21.51 75.92,22.23 IC1.2
N$3
  Top 0.178: IC1.13 83.34,22.54 84.23,22.54 84.28,22.49 84.63,22.14 84.63,16.8 84.63,15.65 84.37,15.38 81.01,12.02 X1.1
N$4
  Top 0.178: IC1.1 73.95,23.81 73.52,23.38 73.52,17.87 73.52,15.65 75.65,13.51 75.65,11.2 76.81,10.05 76.81,8.71 76.28,8.18 74.59,8.18 74.05,8.71 74.05,12.09 74.05,12 X1.3
N$5
  Top 0.178: X1.14 78.5,10.22 78.5,12.89 78.5,15.11 79.92,16.54 80.85,17.46 IC1.9
N$6  (via drill 0.38)
  Top 0.178: v47.92,28.71 46.94,27.74 46.94,15.38 47.47,14.85 47.74,14.58 47.74,11.38 47.74,11.29 48.27,10.76 49.07,10.76 50.69,10.76 X1.11 | v76.1,36.72 78.68,34.14 79,33.81 JP1.2
  Bottom 0.178: v47.92,28.71 52.36,33.16 52.36,37.07 52.72,37.43 75.39,37.43 v76.1,36.72
N$7
  pour Top (rank 2): 9.5,92.75 14.25,92.75 19,88 19,82 9.5,82
N$8
  Top 0.178: IC1.6 78.18,17.46 78.5,17.78 78.5,19.74 78.5,23.02 78.5,24.45 78.14,24.8 76.19,24.8 75.83,25.16 75.83,27.56 76.81,28.54 76.82,28.54 76.82,28.55
  Top 0.254: JP1.3 76.46,28.91 76.82,28.55 76.88,28.5 78.12,28.5 R27.2
N$9
  Top 0.178: U6.1 18.04,8.54 18.5,9 JP2.2
N$10
  Top 0.178: C1.1 18,18.89 18.31,19.2 21.69,19.2 22,18.89 R5.2
N$11
  Top 0.178: 18.04,13.07 U6.8 | 18.04,13.07 17.6,13.51 13.51,13.51 QG1.5 | R5.1 22,14 21.51,13.51 18.49,13.51 18.05,13.07 18.04,13.07
N$12
  pour Top (rank 2): 9.5,100.5 9.5,94 15.5,94 18.25,91.25 25,91.25 25,100.5
N$13
  Top 0.254: C5.1 140.5,59.5 R9.2
N$14
  Top 0.254: U8.1 30.72,27.53 30.25,28 28,28 | 28,28 27.5,27.5 27.5,26.5 R6.1 | R7.1 27.5,28.5 28,28
N$15
  Top 0.178: R21.1 146.77,86.5 147.13,86.14 147.13,86.06 147.13,84.37 146.95,84.19 | R20.1 146.76,84 146.95,84.19 | X6.1 147.38,83.76 147.31,83.76 147.31,83.74 | R19.1 146.84,81.5 147.13,81.79 147.13,83.57 147.31,83.74 | 146.95,84.19 146.95,84.1 147.31,83.74
N$16
  Top 0.178: X6.2 149.97,82.75 149.97,84.1 149.97,87.21 149.62,87.57 146.77,87.57 146.69,87.57 141.26,87.57 139.66,87.57 139.31,87.21 139.31,84.37 138.95,84.01 138.96,84.01 138.96,84 | R26.1 139.01,79 139.31,79.3 139.31,81.25 139.04,81.52 | R24.1 137.88,81.5 137.88,81.52 139.04,81.52 | 138.96,84 R22.1 | 138.96,84 139.22,83.74 139.31,83.66 139.31,82.32 139.31,81.79 139.04,81.52
N$17
  Top 0.178: R25.1 146.84,73.5 147.13,73.79 147.13,75.74 146.86,76.01 | R23.1 145.88,76 145.88,76.01 146.86,76.01 | X6.3 147.37,79.19 147.13,78.94 147.13,76.28 146.86,76.01
N$18  (via drill 0.38)
  Top 0.178: S2.2 7.25,69 12.62,63.62 12.71,63.54 U9.4 | U5.9 40.41,61.75 40.36,61.7 v39.74,61.7
  Bottom 0.178: v39.74,61.7 39.2,61.16 28.36,61.16 27.2,62.32 24,62.32 22.78,63.54 U9.4
N$19  (via drill 0.38)
  Top 0.178: v51.74,53.16 51.74,53.78 U5.38
  Bottom 0.178: v51.74,53.16 51.03,52.45 38.94,52.45 38.23,53.16 28.45,53.16 27.74,52.45 27.38,52.09 23.82,52.09 22.54,53.38 U9.8
N$20
  Top 0.178: JP3.1 18.19,48.69 18.88,49.38 20,49.38 20.75,50.12 20.75,58 21.12,58.38 21.21,58.46 U9.13
N$21
  Top 0.178: JP3.2 20.73,48.6 22,49.88 22,55.5 22.38,55.88 22.42,55.92 U9.12
N$22
  Top 0.178: JP3.3 23.27,53.02 23.62,53.38 25.88,53.38 U9.11
N$23
  Top 0.178: U9.10 25.78,50.84 25.78,50.85 25.81,50.82 JP3.4
N$24  (via drill 0.38)
  Top 0.178: v57.25,58.76 55.21,58.76 U5.46 | v61.34,58.67 61.34,58.23 61.57,58 R31.1
  Bottom 0.178: v57.25,58.76 57.34,58.67 v61.34,58.67
N$25  (via drill 0.38)
  Top 0.178: v43.74,68.9 43.74,68.45 43.75,68.44 U5.79
  Bottom 0.178: v43.74,68.9 43.03,69.61 42.75,69.89 JP4.1
N$26  (via drill 0.38)
  Top 0.178: v42.49,67.65 43.12,67.65 U5.80
  Bottom 0.178: JP4.2 42.19,67.35 v42.49,67.65
N$27
  Top 0.178: U5.1 39.88,65.75 38.94,64.81 37.07,64.81 JP4.3
N$28
  Top 0.178: JP4.4 38.8,62.27 39.2,62.67 39.2,64.54 39.92,65.25 41.34,65.25 U5.2
N$29  (via drill 0.38)
  Top 0.178: U5.22 43.75,56.11 43.83,56.19 v43.83,59.3
  Bottom 0.178: JP4.5 41.35,59.73 41.78,59.3 43.74,59.3 43.83,59.21 v43.83,59.3
N$30  (via drill 0.38)
  Top 0.178: U5.21 43.25,55.78 43.12,55.92 43.12,56.27 43.12,56.36 v43.12,56.45
  Bottom 0.178: v43.12,56.45 42.67,56.9 42.49,57.07 38.76,57.07 38.64,57.19 JP4.6
N$31
  Top 0.178: U5.20 39.8,56.25 39.47,55.92 39.47,55.12 39.03,54.67 36.98,54.67 37,54.67 JP4.7
N$32
  Top 0.178: JP4.8 38.49,52.09 42.41,56.01 42.41,56.54 42.2,56.75 U5.19
N$33  (via drill 0.38)
  Top 0.178: U5.44 53.57,57.75 53.3,57.75 53.25,57.7 52.54,57.7 52.51,57.7 52.51,57.66 52.18,57.34 v52.18,55.92 | R30.1 61.76,55.5 v61.34,55.92
  Bottom 0.178: v52.18,55.92 v61.34,55.92
N$34  (via drill 0.38)
  Top 0.178: v131.84,21.6 131.84,96.28 102.41,96.28 89.08,82.94 89.08,59.46 87.74,58.13 v87.74,56.63 | v128.91,18.67 128.46,18.22 X4.P$5 | v65.61,56.19 65.61,55.83 65.28,55.5 R30.2
  Top 0.254: X4.P$5 124.38,17.88 124,17.5 123,17.5 R28.2
  Bottom 0.178: v65.61,56.19 66.05,56.63 v87.74,56.63 | v131.84,21.6 v128.91,18.67
N$35  (via drill 0.38)
  Top 0.178: v115.48,59.47 v119.93,55.03 | v128.99,53.61 128.64,53.25 128.64,37.87 125.7,34.94 125.7,33.43 125.7,33.16 126.42,32.45 128.73,32.45 129.26,31.91 129.26,26.94 129.26,26.85 129.26,25.78 128.86,25.38 X4.P$2 | v65.61,58.67 65.61,58.32 65.29,58 R31.2
  Top 0.254: X4.P$2 124.12,25.38 124,25.5 122.75,25.5 R29.2
  Bottom 0.178: v65.61,58.67 67.21,60.27 103.03,60.27 103.83,59.47 v115.48,59.47 | v119.93,55.03 120.99,53.96 128.64,53.96 v128.99,53.61
N$36  (via drill 0.38)
  Top 0.178: v87.74,50.05 88.46,49.34 88.46,26.49 88.81,26.14 88.81,17.96 89.52,17.25 89.52,8 86.86,5.33 v86.86,2.4 | U5.45 55.63,58.25 v55.83,58.05 | X4.P$7 125.69,12.88 125.35,12.54 v125.35,11.11
  Bottom 0.178: v55.83,58.05 55.12,57.34 52.63,57.34 51.47,56.19 51.47,55.3 51.83,55.3 53.96,53.16 84.63,53.16 v87.74,50.05 | v125.35,11.11 117.35,3.11 116.73,2.49 115.39,2.49 112.37,2.49 111.57,3.29 97.61,3.29 96.81,2.49 96.72,2.4 95.03,2.4 v86.86,2.4
N$37
  Top 0.178: S2.1 8.31,65.19 12.5,61 12.54,60.96 X3.1
N$38  (via drill 0.38)
  Top 0.178: U5.43 56.1,57.25 56.45,56.9 v56.45,54.85 | R33.1 61.77,53 61.52,53.25 61.52,54.05 v61.52,54.14
  Bottom 0.178: v56.45,54.85 57.7,53.61 60.98,53.61 v61.52,54.14
N$39
  Top 0.178: IC2.3 50.94,80.99 48.27,78.32 5.16,78.32 5.16,73.61 S2.3
N$40  (via drill 0.38)
  Top 0.178: v52.27,69.52 52.27,68.19 U5.62
  Bottom 0.178: v52.27,69.52 52.36,69.61 57.52,69.61 JP5.1
N$41  (via drill 0.38)
  Top 0.178: v53.61,67.65 52.81,67.65 U5.61
  Bottom 0.178: v53.61,67.65 57.52,67.65 JP5.2
N$42
  Top 0.178: U5.60 56.49,65.75 57.34,64.9 57.43,64.81 JP5.3
N$43
  Top 0.178: JP5.4 57.3,62.27 57.07,62.5 57.07,64.63 56.36,65.25 U5.59
N$44
  Top 0.178: U5.39 52.25,53.63 52.81,53.07 54.32,53.07 54.59,52.81 56.45,50.94 60.45,50.94 60.81,51.3 60.81,51.65 60.81,55.38 60.63,55.56 60.63,56.54 60.81,56.72 60.81,57.87 60.19,58.5 59.83,58.5 59.47,58.5 59,58.97 JP5.5
N$45  (via drill 0.38)
  Top 0.178: U5.40 52.75,55.42 52.9,55.56 v52.9,56.63
  Bottom 0.178: v52.9,56.63 53.16,56.9 57.52,56.9 JP5.6
N$46
  Top 0.178: U5.41 55.5,56.25 55.74,56.01 55.74,54.67 55.74,54.59 56.19,54.14 56.27,54.14 56.9,54.14 57.41,54.65 JP5.7
N$47
  Top 0.178: JP5.8 57.52,52.09 53.61,56.01 53.61,56.54 53.82,56.75 U5.42
N$48
  Top 0.178: LED1.C 3.5,39 3.75,39.25 5.75,39.25 6,39 6,37 R34.1
N$49  (via drill 0.38)
  Top 0.178: LED2.A 3.5,31 4,31.5 9,31.5 9.5,32 v9.5,35.25 v9.51,35.25 | U5.24 44.75,44.75 44.45,44.45 v35.56,44.45
  Bottom 0.178: v35.56,44.45 26.36,35.25 v9.51,35.25
N$50
  Top 0.178: LED2.C 3.5,24.5 3.75,24.25 6.25,24.25 6.5,24.5 6.5,26.5 R35.1
N$51
  Top 0.178: C40.2 64,78.75 63.75,79 63.75,79.75 64,80 68.5,80 69,80.5 69.14,80.64 U10.4
N$52
  Top 0.178: C39.2 63.25,81.25 63,81.5 63,84.5 63.25,84.75 68.75,84.75 69,84.5 71,84.5 71,84.44 U10.1
N$53
  Top 0.178: U10.3 69.16,81.91 68.5,81.25 67,81.25 C39.1
N$54
  Top 0.178: U10.5 69.36,79.36 68.75,78.75 67,78.75 C40.1
N$55
  Top 0.178: U10.2 68.83,83.17 68.5,83.5 66.75,83.5 C41.2
N$56
  Top 0.178: X5.3 68,90.75 76.84,81.91 U10.14
N$57
  Top 0.178: U10.6 69.59,78.09 69.25,77.75 69.25,77 68.75,76.5 67,76.5 C42.2
N$58
  Top 0.178: U10.13 82.39,80.64 82.75,81 82.75,88.25 82.5,88.5 73,88.5 70.75,90.75 70.74,90.75 X5.4
N$59
  Top 0.178: R36.1 48,15.12 48.27,14.85 50.23,14.85 50.49,15.11 50.49,16.09 50.5,16.09 C43.2
N$60
  Top 0.254: U11.1 151.29,46.46 151,46.75 150.88,46.88 149.88,46.88 149.38,46.88 149.35,46.85 R8.1 148,46.88 R37.1
PPTBUS1  (via drill 0.38)
  Top 0.178: R3.2 30,7 29.5,6.5 26,6.5 JP2.1 | IC1.10 79.8,18.73 79.39,18.31 79.39,17.96 79.39,16.71 77.97,15.29 77.97,14.31 77.97,11.11 v77.61,10.76
  Bottom 0.178: v77.61,10.76 77.43,10.58 43.83,10.58 40.01,6.76 39.71,6.46 JP2.1
PPTBUS2  (via drill 0.38)
  Top 0.178: v58.14,38.85 57.78,38.49 57.78,38.41 57.78,36.09 58.23,35.65 58.23,35.38 58.1,35.25 U2.P$33 | v47.65,25.69 v51.83,21.51
  Bottom 0.178: v58.14,38.85 57.43,39.56 51.74,39.56 45.7,33.52 45.7,26.14 46.14,25.69 v47.65,25.69 | v51.83,21.51 53.43,19.91 55.47,19.91 59.83,15.56 60.27,15.56 62.59,13.25 63.3,13.25 63.74,13.25 64.45,12.54 64.45,11.47 64.99,10.94 65.96,10.94 75.3,10.94 76.01,11.65 76.1,11.65 X1.2
PPTBUS3  (via drill 0.38)
  Top 0.178: v74.5,39.92 75.39,39.03 75.39,26.14 75.39,26.05 75.39,24.8 75.74,24.45 77.34,24.45 77.7,24.09 77.7,23.82 77.7,22.58 77.7,20.36 77.34,20 IC1.4 | U2.P$32 59.25,38.45 59.3,38.49 v59.3,39.03
  Bottom 0.178: v59.3,39.03 60.19,39.92 v74.5,39.92
PPTBUS4  (via drill 0.38)
  Top 0.178: v60.45,39.2 59.83,38.58 59.75,38.5 U2.P$31 | v86.23,39.56 85.88,39.2 85.88,15.11 v83.83,13.07
  Bottom 0.178: v60.45,39.2 83.83,39.2 84.19,39.56 v86.23,39.56 | v83.83,13.07 73.43,13.07 72.72,12.36 72.01,12.36 X1.4
PPTBUS5
  Top 0.178: X1.5 68.54,12.71 68.54,13.25 67.74,14.05 67.74,15.82 68.54,16.62 68.54,25.6 66.32,27.74 63.21,27.74 61.96,28.98 61.96,30.32 61.96,30.94 61.52,31.38 61.52,36.27 61.75,36.5 U2.P$27
PPTBUS6  (via drill 0.38)
  Top 0.178: v65.08,40.63 62.94,38.49 62.75,38.3 U2.P$25 | v72.54,40.63 72.81,40.36 v72.81,13.78
  Bottom 0.178: v72.54,40.63 v65.08,40.63 | v72.81,13.78 72.28,13.07 67.21,13.07 66.5,12.36 X1.6
PPTBUS7  (via drill 0.38)
  Top 0.178: v62.94,29.25 63.21,29.52 63.25,29.56 U2.P$24
  Bottom 0.178: v62.94,29.25 61.61,27.91 59.38,27.91 56.27,24.8 50.41,24.8 49.96,24.36 49.96,19.74 50.41,19.29 54.59,19.29 61.52,12.36 62.32,12.36 X1.7
PPTBUS8  (via drill 0.38)
  Top 0.178: v63.74,28.54 63.74,36.63 U2.P$23 | v54.14,23.91 53.96,23.74 v53.96,16.18
  Bottom 0.178: v54.14,23.91 60.19,23.91 63.74,27.47 63.74,28.45 v63.74,28.54 | v53.96,16.18 57.07,13.07 58.67,13.07 59.47,12.27 X1.8
PPTBUS9  (via drill 0.38)
  Top 0.178: v52.18,38.49 52.36,38.32 52.36,22.94 52.54,22.76 52.54,18.94 v52.18,18.58 | U2.P$22 64.25,38.43 v64.19,38.49
  Bottom 0.178: v64.19,38.49 63.83,38.14 52.54,38.14 v52.18,38.49 | v52.18,18.58 52.18,15.11 52.18,15.02 53.25,13.96 55.21,13.96 56.81,12.36 X1.9
PPTBUS11  (via drill 0.38)
  Top 0.178: v64.72,19.47 61.25,22.94 61.25,25.16 U2.P$53 | IC1.5 74.61,18.73 74.23,19.11 v74.23,19.82
  Bottom 0.178: v64.72,19.47 65.08,19.82 v74.23,19.82
PPTBUS12  (via drill 0.38)
  Top 0.178: v60.01,35.65 60.01,34.76 60.01,34.58 59.67,34.25 U2.P$35 | v80.72,34.76 81.25,34.23 81.54,33.94 JP1.1 | v53.43,35.29 53.43,16.62 49.52,12.71 X1.12
  Bottom 0.178: v80.72,34.76 71.03,34.76 70.5,35.29 60.36,35.29 v60.01,35.65 59.65,35.65 53.78,35.65 v53.43,35.29
PPTBUS13  (via drill 0.38)
  Top 0.178: v65.43,32.8 65.43,36.27 65.25,36.45 65.25,36.63 U2.P$20 | v46.41,28.18 46.41,12.71 X1.13
  Bottom 0.178: v65.43,32.8 64.54,31.91 52.09,31.91 48.18,28 46.58,28 v46.41,28.18
PPTBUS14  (via drill 0.38)
  Top 0.178: v84.81,41.34 85.17,40.98 85.17,27.47 82.14,24.45 79.65,24.45 79.3,24.09 79.3,20.98 79.3,19.82 79.74,19.38 80.9,19.38 83.39,19.38 83.74,19.38 84.1,19.02 84.1,16.54 83.75,16.19 IC1.8 | U2.P$30 60.25,38.02 60.9,38.67 60.98,38.76 v63.21,40.98
  Bottom 0.178: v63.21,40.98 63.56,41.34 v84.81,41.34
PPTBUS15  (via drill 0.38)
  Top 0.178: v74.5,36.72 74.85,36.36 74.85,26.4 74.85,25.51 73.17,23.82 73.17,17.87 73.17,17.51 73.17,15.11 75.3,12.8 75.3,10.05 X1.15 | U2.P$34 58.31,34.75 58.59,35.03 58.59,35.92 58.5,36.01 v58.5,36.36
  Bottom 0.178: v58.5,36.36 58.85,36.72 v74.5,36.72
PPTBUS16  (via drill 0.38)
  Top 0.178: v59.92,27.03 59.92,30.49 60.72,31.29 60.75,31.32 U2.P$29 | v57.52,18.85 v57.52,24.62 | X1.16 72.65,10.78 72.9,11.02 72.9,12.62 v71.74,13.78
  Bottom 0.178: v57.52,24.62 v59.92,27.03 | v57.52,18.85 62.59,13.78 v71.74,13.78
PPTBUS17  (via drill 0.38)
  Top 0.178: v61.16,30.76 61.16,36.45 61.25,36.54 61.25,36.63 U2.P$28 | v64.72,31.2 66.5,29.43 66.5,28.63 66.5,28.36 68.1,26.76 68.54,26.31 68.9,25.96 68.9,25.43 68.9,24.62 68.9,16.27 68.36,15.73 68.36,14.49 69.61,13.25 69.61,11.02 69.91,10.72 X1.17
  Bottom 0.178: v61.16,30.76 61.61,31.2 v64.72,31.2
PROG_OSC  (via drill 0.38)
  Top 0.178: R4.2 26.05,15.56 26.05,12.27 JP2.3 | v66.94,42.41 66.94,38.85 66.94,38.67 66.75,38.48 U2.P$17 | v53.43,42.41 52.9,41.87 52.9,35.74 52.72,35.56 52.72,28.8 52.9,28.63 52.9,18.31 52.45,17.87 51.21,17.87 C43.1 50.5,18.57 50.23,18.85 49.34,18.85 v49.25,18.85
  Bottom 0.178: v53.43,42.41 v66.94,42.41 | v49.25,18.85 46.94,16.54 44.98,14.58 36.27,14.58 33.23,11.54 JP2.3
SD_CS  (via drill 0.38)
  Top 0.178: R32.2 123.04,29.25 123.04,49.16 121.44,50.76 121.44,51.03 121.17,51.3 120.55,51.3 120.46,51.21 v120.02,51.21 | v65.08,49.43 65.08,51.03 65.61,51.56 65.61,51.65 65.61,52.72 65.33,53 R33.2
  Top 0.254: X4.P$1 124.62,27.88 124,28.5 123,28.5 R32.2
  Bottom 0.178: v65.08,49.43 66.5,48.01 85.7,48.01 86.06,47.65 106.15,47.65 106.5,47.3 110.06,47.3 113.97,51.21 v120.02,51.21
SER_RX  (via drill 0.38)
  Top 0.178: v46.67,75.21 41.78,70.32 41.78,70.23 41.78,67.12 42.23,66.67 43.12,66.67 45.25,64.54 45.25,62.41 45.25,62.14 44.9,61.78 43.83,61.78 42.86,62.75 U5.7 | v79.3,78.5 79.92,79.12 U10.12
  Bottom 0.178: v46.67,75.21 49.96,78.5 v79.3,78.5
SER_TX  (via drill 0.38)
  Top 0.178: v42.67,64.01 42.67,63.3 42.05,63.3 U5.6 | v68.9,68.81 77.88,77.79 79.92,77.79 U10.11
  Bottom 0.178: v42.67,64.01 42.67,66.59 43.03,66.94 44.98,66.94 46.85,68.81 v68.9,68.81
XCBUS2  (via drill 0.38)
  Top 0.178: v73.08,65.25 70.41,62.59 70.41,36.36 70.41,34.14 70.02,33.75 U2.P$13 | v100.99,68.45 101.35,68.45 101.35,68.36 101.44,68.28 101.61,68.28 U1.P$2
  Bottom 0.178: v73.08,65.25 75.65,67.83 100.37,67.83 v100.99,68.45
XCBUS3  (via drill 0.38)
  Top 0.178: v100.55,81.25 100.55,79.57 100.28,79.3 100.28,67.74 101.61,67.74 U1.P$3 | v109.17,81.43 109.61,81.88 109.8,82.06 U3.32
  Bottom 0.178: v100.55,81.25 100.72,81.43 v109.17,81.43
XCBUS4  (via drill 0.38)
  Top 0.178: v99.83,79.83 99.83,67.3 101.61,67.3 U1.P$4 | U3.24 103.4,81.8 103.3,81.7 103.3,79.74 v103.3,79.83
  Bottom 0.178: v99.83,79.83 v103.3,79.83
XCBUS5  (via drill 0.38)
  Top 0.178: v103.48,66.41 103.48,66.67 102.86,66.67 U1.P$5 | U3.31 109,82.42 108.46,81.88 108.46,80.99 108.1,80.63 107.66,80.63 v107.48,80.63
  Bottom 0.178: v103.48,66.41 103.48,67.3 101.44,69.34 99.03,69.34 97.35,71.03 97.35,72.01 97.7,72.36 102.06,72.36 103.03,72.36 105.7,75.03 105.7,76.01 105.7,78.5 105.7,78.85 v107.48,80.63
XCBUS6  (via drill 0.38)
  Top 0.178: v99.12,80.54 99.12,79.57 99.48,79.21 99.48,66.32 101.61,66.32 U1.P$6 | U3.25 104.2,81.44 104.01,81.25 v104.01,80.54
  Bottom 0.178: v99.12,80.54 v104.01,80.54
XCBUS7  (via drill 0.38)
  Top 0.178: v98.41,81.25 98.41,79.74 99.12,79.03 99.12,65.79 101.61,65.79 U1.P$7 | v107.84,82.14 108.19,82.5 108.2,82.6 U3.30
  Bottom 0.178: v98.41,81.25 100.1,82.94 106.86,82.94 107.48,82.94 107.84,82.59 v107.84,82.14
XCBUS10  (via drill 0.38)
  Top 0.178: v98.41,74.32 98.77,73.97 98.77,64.01 101.26,64.01 101.44,64.19 101.61,64.19 U1.P$10 | v104.99,80.72 104.99,82.77 U3.26
  Bottom 0.178: v98.41,74.32 99.12,74.32 104.99,80.19 v104.99,80.72
XCBUS11  (via drill 0.38)
  Top 0.178: v104.19,67.12 104.19,63.83 102.86,63.83 U1.P$11 | v101.26,70.05 101.26,81.88 v100.9,82.23 | U3.29 107.4,82.78 v106.77,82.14
  Bottom 0.178: v104.19,67.12 v101.26,70.05 | v100.9,82.23 100.99,82.14 v106.77,82.14
XCBUS12  (via drill 0.38)
  Top 0.178: v100.55,63.21 101.61,63.21 U1.P$12 | v142.33,71.65 142.33,75.3 142.06,75.56 142.06,76.36 142.33,76.63 142.33,80.9 142.15,81.08 142.15,81.88 142.33,82.06 142.33,82.77 142.33,83.74 142.59,84 R20.2
  Bottom 0.178: v100.55,63.21 100.81,62.94 113.44,62.94 114.95,61.43 130.86,61.43 138.24,68.81 139.48,68.81 v142.33,71.65
XCBUS13  (via drill 0.38)
  Top 0.178: v109.26,64.72 109.26,62.76 102.86,62.76 U1.P$13 | v142.91,81.5 143.75,81.52 R19.2
  Bottom 0.178: v109.26,64.72 111.92,67.39 123.66,67.39 126.33,70.05 131.93,70.05 132.37,70.05 132.91,70.59 139.75,70.59 141.62,72.45 141.62,80.81 141.62,81.08 142.04,81.5 v142.91,81.5
XCBUS19  (via drill 0.38)
  Top 0.178: v109.97,69.25 109.97,59.83 102.86,59.83 U1.P$19 | v134.5,81.5 R24.2
  Bottom 0.178: v109.97,69.25 116.9,76.19 130.95,76.19 133.69,76.19 134.5,77 v134.5,81.5
XCBUS20  (via drill 0.38)
  Top 0.178: v114.24,60.19 114.24,59.3 102.86,59.3 U1.P$20 | v132.55,60.01 132.73,60.19 132.73,80.45 132.73,82.14 134.58,84 R22.2
  Bottom 0.178: v114.24,60.19 114.77,60.72 124.02,60.72 124.73,60.01 v132.55,60.01
XCBUS21  (via drill 0.38)
  Top 0.178: v114.06,57.34 114.06,58.67 102.86,58.67 U1.P$21 | R25.2 143.29,73.5 142.95,73.17 142.95,72.19 143.13,72.01 143.13,64.81 142.69,64.36 142.69,63.48 v142.69,63.56
  Bottom 0.178: v114.06,57.34 134.24,57.34 134.68,57.78 136.91,57.78 v142.69,63.56
XCBUS22  (via drill 0.38)
  Top 0.178: v116.37,60.01 116.37,60.19 115.21,60.19 114.77,59.74 114.77,56.63 113.79,56.63 113.35,57.07 113.35,58.23 102.86,58.23 U1.P$22 | v142.91,76 143.75,76 R23.2
  Bottom 0.178: v116.37,60.01 116.9,59.47 120.81,59.47 121.97,58.32 126.86,58.32 128.1,59.56 132.02,59.56 132.28,59.3 133.17,59.3 133.92,59.3 136.88,62.25 136.88,66.38 138.62,68.12 139.78,68.12 140.11,68.45 143.13,71.48 143.13,72.99 142.95,73.17 142.95,76.01 v142.91,76
XCBUS23  (via drill 0.38)
  Top 0.178: v112.64,57.34 112.64,57.7 102.86,57.7 U1.P$23 | v133.53,56.63 135.04,58.14 145.02,58.14 145.5,58.62 145.52,58.62 145.52,58.64 145.53,58.64 145.53,64.99 145.53,67.92 147.84,70.23 152.11,70.23 154.78,72.9 154.78,78.19 X6.13
  Bottom 0.178: v112.64,57.34 113.35,56.63 v133.53,56.63
XCBUS26  (via drill 0.38)
  Top 0.178: v96.63,81.43 96.63,65.08 96.63,62.5 98.77,60.36 98.77,57.96 100.48,56.25 U1.P$26 | v137.88,88.46 151.4,88.46 151.49,88.46 152.2,88.46 152.55,88.1 152.55,80.37 152.55,78.13 X6.14
  Bottom 0.178: v96.63,81.43 103.66,88.46 v137.88,88.46
XCBUS27  (via drill 0.38)
  Top 0.178: v66.32,14.49 65.79,15.02 65.79,15.11 65.79,24.98 65.75,25.02 U2.P$62 | v97.17,44.45 104.19,51.47 104.19,55.74 102.86,55.74 U1.P$27 | v93.97,43.03 94.32,42.67 94.32,21.34 93.34,20.36 v93.34,13.78 | U4.17 96.25,7.5 96.19,7.56 v96.19,12.89
  Bottom 0.178: v96.19,12.89 95.3,13.78 v93.34,13.78 75.39,13.78 74.68,14.49 v66.32,14.49 | v97.17,44.45 95.75,43.03 v93.97,43.03
XCBUS28  (via drill 0.38)
  Top 0.178: v75.03,2.76 68.19,9.6 68.19,10.76 67.03,11.91 67.03,15.56 66.32,16.27 66.25,16.34 U2.P$63 | v100.46,55.21 101.61,55.21 U1.P$28 | v94.68,51.83 95.03,51.47 95.03,20.54 v94.68,20.18 | v97.08,19.82 96.9,19.65 96.9,10.67 96.72,10.49 96.72,8 96.75,7.97 U4.18 96.75,4.38 96.72,4.36 v96.72,3.47
  Bottom 0.178: v96.72,3.47 96.01,2.76 87.83,2.76 87.48,3.11 86.23,3.11 85.88,2.76 v75.03,2.76 | v100.46,55.21 97.08,51.83 v94.68,51.83 | v94.68,20.18 95.03,19.82 v97.08,19.82
XCBUS29  (via drill 0.38)
  Top 0.178: v97.61,15.91 97.61,10.85 97.08,10.31 97.08,9.78 97.17,9.69 97.25,9.61 U4.19 | 66.85,16.71 v67.12,16.45 66.85,16.71 | v103.48,54.67 102.86,54.67 U1.P$29 | v94.32,49.78 94.68,49.43 94.68,21.16 93.7,20.18 93.7,16.27 v94.06,15.91 | U2.P$64 66.75,16.82 66.85,16.71
  Bottom 0.178: v97.61,15.91 97.26,15.56 94.06,15.56 | 94.06,15.56 72.54,15.56 71.65,16.45 v67.12,16.45 | v103.48,54.67 98.59,49.78 v94.32,49.78 | 94.06,15.56 v94.06,15.91
XCBUS30  (via drill 0.38)
  Top 0.178: v63.56,63.56 66.32,60.81 66.32,55.92 66.32,51.38 66.23,51.3 65.79,50.85 65.79,48.98 65.75,48.95 U2.P$19 | v52.18,63.56 51.83,63.92 51.75,64 U5.63 | v112.64,34.05 114.77,31.91 114.77,26.85 114.77,26.31 115.66,25.43 116.27,24.81 JP6.17 | v90.94,33.34 89.17,35.12 89.17,56.36 89.17,57.79 89.88,58.5 | R17.2 91.12,58.5 89.88,58.5 | v94.59,62.59 94.59,61.91 94.88,61.62 94.88,60.25 | 94.88,60.25 94.5,59.88 94.38,59.75 91.62,59.75 90.25,59.75 89.88,59.38 89.88,58.5 | U1.P$30 100.12,54.25 98.38,56 98.38,56.75 94.88,60.25
  Bottom 0.178: v52.18,63.56 v63.56,63.56 63.92,63.39 64.72,62.59 v94.59,62.59 | v112.64,34.05 112.28,33.69 91.3,33.69 v90.94,33.34
XCBUS31  (via drill 0.38)
  Top 0.178: v66.59,50.14 69.88,46.85 69.88,36.36 69.88,36.27 70.05,36.09 70.05,35.03 69.78,34.75 U2.P$15 | v48.54,49.96 47.3,51.21 47.25,51.25 U5.29 | v98.23,53.96 98.23,53.78 101.61,53.78 U1.P$31 | v112.64,31.2 112.64,27.83 112.64,27.74 112.64,26.67 112.88,26.43 JP6.20 | v97.79,31.74 96.46,33.07 96.46,54.41 v96.1,54.76 | R16.2 93.8,56 93.97,55.83 v93.97,54.76 | v93.97,54.76 94.06,54.67 v93.97,54.76
  Bottom 0.178: v48.54,49.96 50.58,49.96 50.76,50.14 v66.59,50.14 66.94,49.96 67.56,49.34 89.17,49.34 93.43,53.61 93.43,54.59 93.61,54.59 v93.97,54.76 v96.1,54.76 97.43,54.76 v98.23,53.96 | v97.79,31.74 107.39,31.74 107.92,31.2 v112.64,31.2
XCBUS32  (via drill 0.38)
  Top 0.178: v97.52,56.19 97.52,53.25 101.61,53.25 U1.P$32 | v89.88,56 90.38,56 91.12,56 R16.1
  Bottom 0.178: v97.52,56.19 96.55,56.19 90.68,56.19 90.5,56.01 v89.88,56
XCBUS34
  Top 0.178: R17.1 94.38,58.5 94.88,59 95.5,59 96.5,58 96.62,57.88 96.62,55.5 97,55.12 97,53.25 97,52.75 97.5,52.25 U1.P$34
XCBUS37  (via drill 0.38)
  Top 0.178: v69.16,46.58 69.16,36.36 69.16,36.18 69.7,35.65 69.7,35.38 69.56,35.25 U2.P$16 | U1.P$37 104.25,48.24 103.92,47.92 102.86,47.92 v101.52,46.58
  Bottom 0.178: v69.16,46.58 v101.52,46.58
XCBUS38  (via drill 0.38)
  Top 0.178: v68.19,46.58 66.41,44.81 66.25,44.65 U2.P$18 | v85.61,68.54 84.81,67.74 v84.81,47.3 | U1.P$38 104.75,47.23 104.46,46.94 103.3,46.94 v103.21,46.94 | v105,79.25 104.5,78.75 R15.2
  Bottom 0.178: v68.19,46.58 68.9,47.3 v84.81,47.3 102.86,47.3 v103.21,46.94 | v85.61,68.54 90.5,73.43 98.5,73.43 99.21,73.43 104.99,79.21 105,79.21 v105,79.25
XCBUS39  (via drill 0.38)
  Top 0.178: v71.12,8.45 70.94,8.62 70.94,10.4 69.96,11.38 69.96,12.62 70.41,13.07 70.41,27.83 69.98,28.25 U2.P$2 | v105.26,50.49 105.26,49.87 U1.P$39 | v106.77,48.01 106.06,47.3 106.06,44.09 105.08,43.12 105.08,11.29 104.9,11.11 v104.9,10.05 | U4.21 98.25,8.02 98.5,8.27 v98.5,9.34
  Bottom 0.178: v71.12,8.45 72.81,8.45 73.52,7.73 96.9,7.73 v98.5,9.34 98.86,9.34 104.19,9.34 v104.9,10.05 | v105.26,50.49 105.26,48.01 v106.77,48.01
XCBUS40  (via drill 0.38)
  Top 0.178: v103.92,10.05 104.55,10.67 104.55,15.73 | 104.55,15.73 104.55,44.18 105.7,45.34 105.7,48.63 U1.P$40 | v104.37,15.73 104.55,15.73 | U4.20 97.75,8.76 97.79,8.8 v97.79,10.05 | U2.P$1 69.77,27.75 70.05,27.47 70.05,24.89 69.25,24.09 v69.25,15.2
  Bottom 0.178: v103.92,10.05 v97.79,10.05 | v69.25,15.2 100.99,15.2 101.52,15.73 v104.37,15.73
XCBUS41  (via drill 0.38)
  Top 0.178: v107.57,37.07 107.57,4.36 103.83,4.36 102.77,5.42 102.77,5.6 U4.30 | v97.79,37.07 97.43,37.43 v97.43,40.27 97.43,43.65 104.99,51.21 106.24,51.21 106.24,49.87 U1.P$41 | v66.41,36.01 66.41,33.25 66.41,33.16 66.73,32.84 66.73,32.8 66.76,32.8 67.56,32.8 67.62,32.75 U2.P$11 | v77.43,37.07 79.3,38.94 v79.3,39.92
  Bottom 0.178: v97.79,37.07 v107.57,37.07 | v66.41,36.01 66.76,36.36 73.88,36.36 74.23,36.01 76.36,36.01 v77.43,37.07 | v79.3,39.92 79.65,40.27 v97.43,40.27
XCBUS42  (via drill 0.38)
  Top 0.178: v88.63,8.45 88.1,7.91 83.74,7.91 83.66,7.91 83.12,8.45 83.12,13.42 85.08,15.38 85.08,16.45 85.08,22.76 v84.1,23.74 84.28,23.91 85.52,25.16 85.52,47.56 v86.32,48.36 | v106.68,51.92 106.68,49.87 U1.P$42 | U4.31 103.25,9.47 103.21,9.51 v103.21,11.56 | U2.P$57 63.25,24.94 63.56,24.54 v63.92,24.09
  Bottom 0.178: v103.21,11.56 103.12,11.47 91.66,11.47 v88.63,8.45 | v84.1,23.74 83.39,24.45 76.01,24.45 75.65,24.09 v63.92,24.09 | v106.68,51.92 106.32,51.56 104.28,51.56 101.79,49.07 89.43,49.07 88.72,48.36 v86.32,48.36
XCBUS43  (via drill 0.38)
  Top 0.178: v106.86,38.49 106.86,4.71 104.28,4.71 104.19,4.71 103.75,5.15 U4.32 | v68.45,38.49 67.21,37.25 67.21,34.94 66.76,34.49 66.76,34.05 67.56,33.25 68.19,33.25 U2.P$12 | v108.72,51.92 107.3,50.49 107.3,49.87 U1.P$43 | v125.44,42.67 v125.44,51.92
  Bottom 0.178: v68.45,38.49 79.83,38.49 80.19,38.14 106.5,38.14 v106.86,38.49 107.21,38.67 121.44,38.67 v125.44,42.67 | v125.44,51.92 v108.72,51.92
XCBUS44  (via drill 0.38)
  Top 0.178: v105.61,10.85 105.79,11.02 105.79,43.29 107.75,45.25 107.75,48.63 U1.P$44 | v87.74,26.67 88.46,25.96 88.46,17.78 89.17,17.07 89.17,13.42 v88.81,13.07 | v98.32,12.18 99.48,11.02 v99.75,10.76 99.75,9.6 99.75,8.53 98.75,7.54 U4.22 | U2.P$4 69.87,29.25 v70.05,29.07
  Bottom 0.178: v99.75,10.76 99.83,10.85 v105.61,10.85 | v70.05,29.07 72.45,26.67 v87.74,26.67 | v88.81,13.07 89.7,12.18 v98.32,12.18
XCBUS46  (via drill 0.38)
  Top 0.178: v104.55,5.42 106.32,7.2 106.32,38.05 106.15,38.23 106.15,43.12 108.72,45.7 108.72,48.63 U1.P$46 | v99.3,4.98 99.3,5.42 99.25,5.47 U4.23 | U2.P$5 70.44,29.75 70.76,29.43 70.76,29.25 70.76,18.05 70.76,13.51 71.21,13.07 71.83,13.07 72.36,12.54 72.36,11.29 71.48,10.4 71.48,9.16 72.19,8.45 v72.19,7.73
  Bottom 0.178: v104.55,5.42 99.75,5.42 v99.3,4.98 98.95,5.16 95.48,5.16 93.26,7.38 73.43,7.38 72.54,7.38 v72.19,7.73
XCBUS47  (via drill 0.38)
  Top 0.178: v104.55,45.16 104.19,44.81 104.19,27.38 104.19,27.11 103.75,26.67 U4.1 103.75,25.34 103.75,18.76 v103.21,18.22 | v109.17,45.16 109.17,48.63 U1.P$47 | v91.66,5.96 94.77,9.07 94.77,17.16 v94.41,17.51 | v52,8 52,10.25 52.5,10.75 53.38,11.62 53.38,12.12 53.38,12.93 54.67,14.22 54.67,21.87 54.85,22.05 54.85,28.09 54.85,29.96 55.14,30.25 U2.P$43
  Bottom 0.178: v104.55,45.16 v109.17,45.16 | v91.66,5.96 90.68,5.96 89.97,6.67 72.1,6.67 71.74,6.31 56.54,6.31 52.44,6.31 52,6.75 v52,8 | v94.41,17.51 95.12,18.22 v103.21,18.22
XCBUS48  (via drill 0.38)
  Top 0.178: v100.19,27.83 100.55,28.18 v100.55,39.92 | v106.86,40.72 109.88,43.74 109.88,48.09 109.88,48.18 109.75,48.31 U1.P$48 | v55.38,21.6 55.38,27.56 55.38,29.43 55.71,29.75 U2.P$44 | v93.08,21.96 93.61,22.49 v93.61,26.31 | v103.48,27.56 103.48,26.94 103.3,26.76 103.25,26.71 U4.2
  Bottom 0.178: v103.48,27.56 103.3,27.74 103.21,27.83 102.68,27.83 v100.19,27.83 99.92,27.56 94.86,27.56 v93.61,26.31 | v100.55,39.92 101.35,40.72 v106.86,40.72 | v55.38,21.6 92.72,21.6 v93.08,21.96
XCBUS49  (via drill 0.38)
  Top 0.178: v100.46,12.18 100.46,7.11 100.28,6.93 100.28,6.67 U4.25 | v92.63,14.49 92.37,14.76 v92.37,34.76 92.55,35.12 92.55,46.94 v93.97,48.36 | v71.12,35.65 71.12,31.65 71.12,31.56 71.12,30.67 70.7,30.25 U2.P$6 | v110.24,50.49 110.24,49.87 U1.P$49
  Bottom 0.178: v100.46,12.18 98.15,14.49 v92.63,14.49 | v92.37,34.76 92.01,35.12 81.34,35.12 80.81,35.65 v71.12,35.65 | v110.24,50.49 109.53,51.21 104.46,51.21 101.61,48.36 v93.97,48.36
XCBUS50  (via drill 0.38)
  Top 0.178: v103.57,45.16 103.57,30.58 103.03,30.05 102.95,29.96 v102.95,28.54 102.75,28.34 U4.3 | v110.77,45.87 110.77,48.63 U1.P$50 | v55.03,3.73 55.03,10.22 55.83,11.02 55.83,21.07 56.1,21.34 56.1,21.87 55.74,22.23 55.74,27.11 55.74,28.89 56.1,29.25 U2.P$45 | v88.28,3.47 88.28,6.22 89.88,7.82 89.88,24.98 89.17,25.69 v89.17,26.76
  Bottom 0.178: v103.57,45.16 104.28,45.87 v110.77,45.87 | v55.03,3.73 55.3,3.47 v88.28,3.47 | v89.17,26.76 90.32,27.91 99.3,27.91 99.92,28.54 v102.95,28.54
XCBUS51  (via drill 0.38)
  Top 0.178: v102.5,46.23 102.5,45.25 102.86,44.9 102.86,30.4 102.41,29.96 102.41,29.43 102.23,29.25 102.06,29.07 v102.06,27.11 102.06,26.76 102.25,26.57 U4.4 | v111.48,46.58 111.21,46.58 111.21,48.63 U1.P$51 | v57.34,5.6 57.34,10.05 56.36,11.02 56.27,11.11 56.27,20.98 56.54,21.25 56.54,22.05 56.19,22.4 56.19,23.29 56.19,25.96 56.19,26.05 56.19,28.45 56.49,28.75 U2.P$46 | v89.88,25.96 90.23,25.6 90.23,7.56 88.99,6.31 v88.99,5.96
  Bottom 0.178: v102.5,46.23 110.15,46.23 110.5,46.58 v111.48,46.58 | v88.99,5.96 88.63,6.31 72.28,6.31 71.92,5.96 66.59,5.96 57.7,5.96 v57.34,5.6 | v89.88,25.96 90.23,25.6 99.75,25.6 99.83,25.69 100.64,25.69 v102.06,27.11
XCBUS54  (via drill 0.38)
  Top 0.178: 112.55,44.18 112.55,41.69 111.57,40.72 v111.57,22.4 | 112.55,44.18 112.55,48.27 112.72,48.45 112.72,48.63 U1.P$54 | v52.9,58.41 53.7,59.21 53.74,59.25 U5.47 | v112.72,44.18 112.55,44.18 | v49.61,53.16 49.61,44.27 v52.18,41.69 52.09,41.69 50.94,41.69 50.67,41.43 49.25,40.01 49.25,39.83 49.25,38.58 49.78,38.05 50.85,36.98 v50.85,28.27 | U2.P$47 58.48,28.25 v58.5,28.27 | U4.5 101.75,23.87 101.79,23.82 v101.79,23.02
  Bottom 0.178: v101.79,23.02 102.41,22.4 v111.57,22.4 114.86,22.4 115.57,21.69 JP6.15 | v52.9,58.41 51.21,56.72 47.3,56.72 | 47.3,56.72 44.36,56.72 43.38,55.74 28.63,55.74 27.56,54.67 16.62,54.67 14.82,52.87 X3.4 | v112.72,44.18 112.64,44.09 102.5,44.09 100.72,45.87 83.12,45.87 78.94,41.69 v52.18,41.69 | v49.61,53.16 47.3,55.47 47.3,56.72 | v50.85,28.27 v58.5,28.27
XCBUS56  (via drill 0.38)